# Altium project PCIE to MXM Riser Basic.PrjPcb
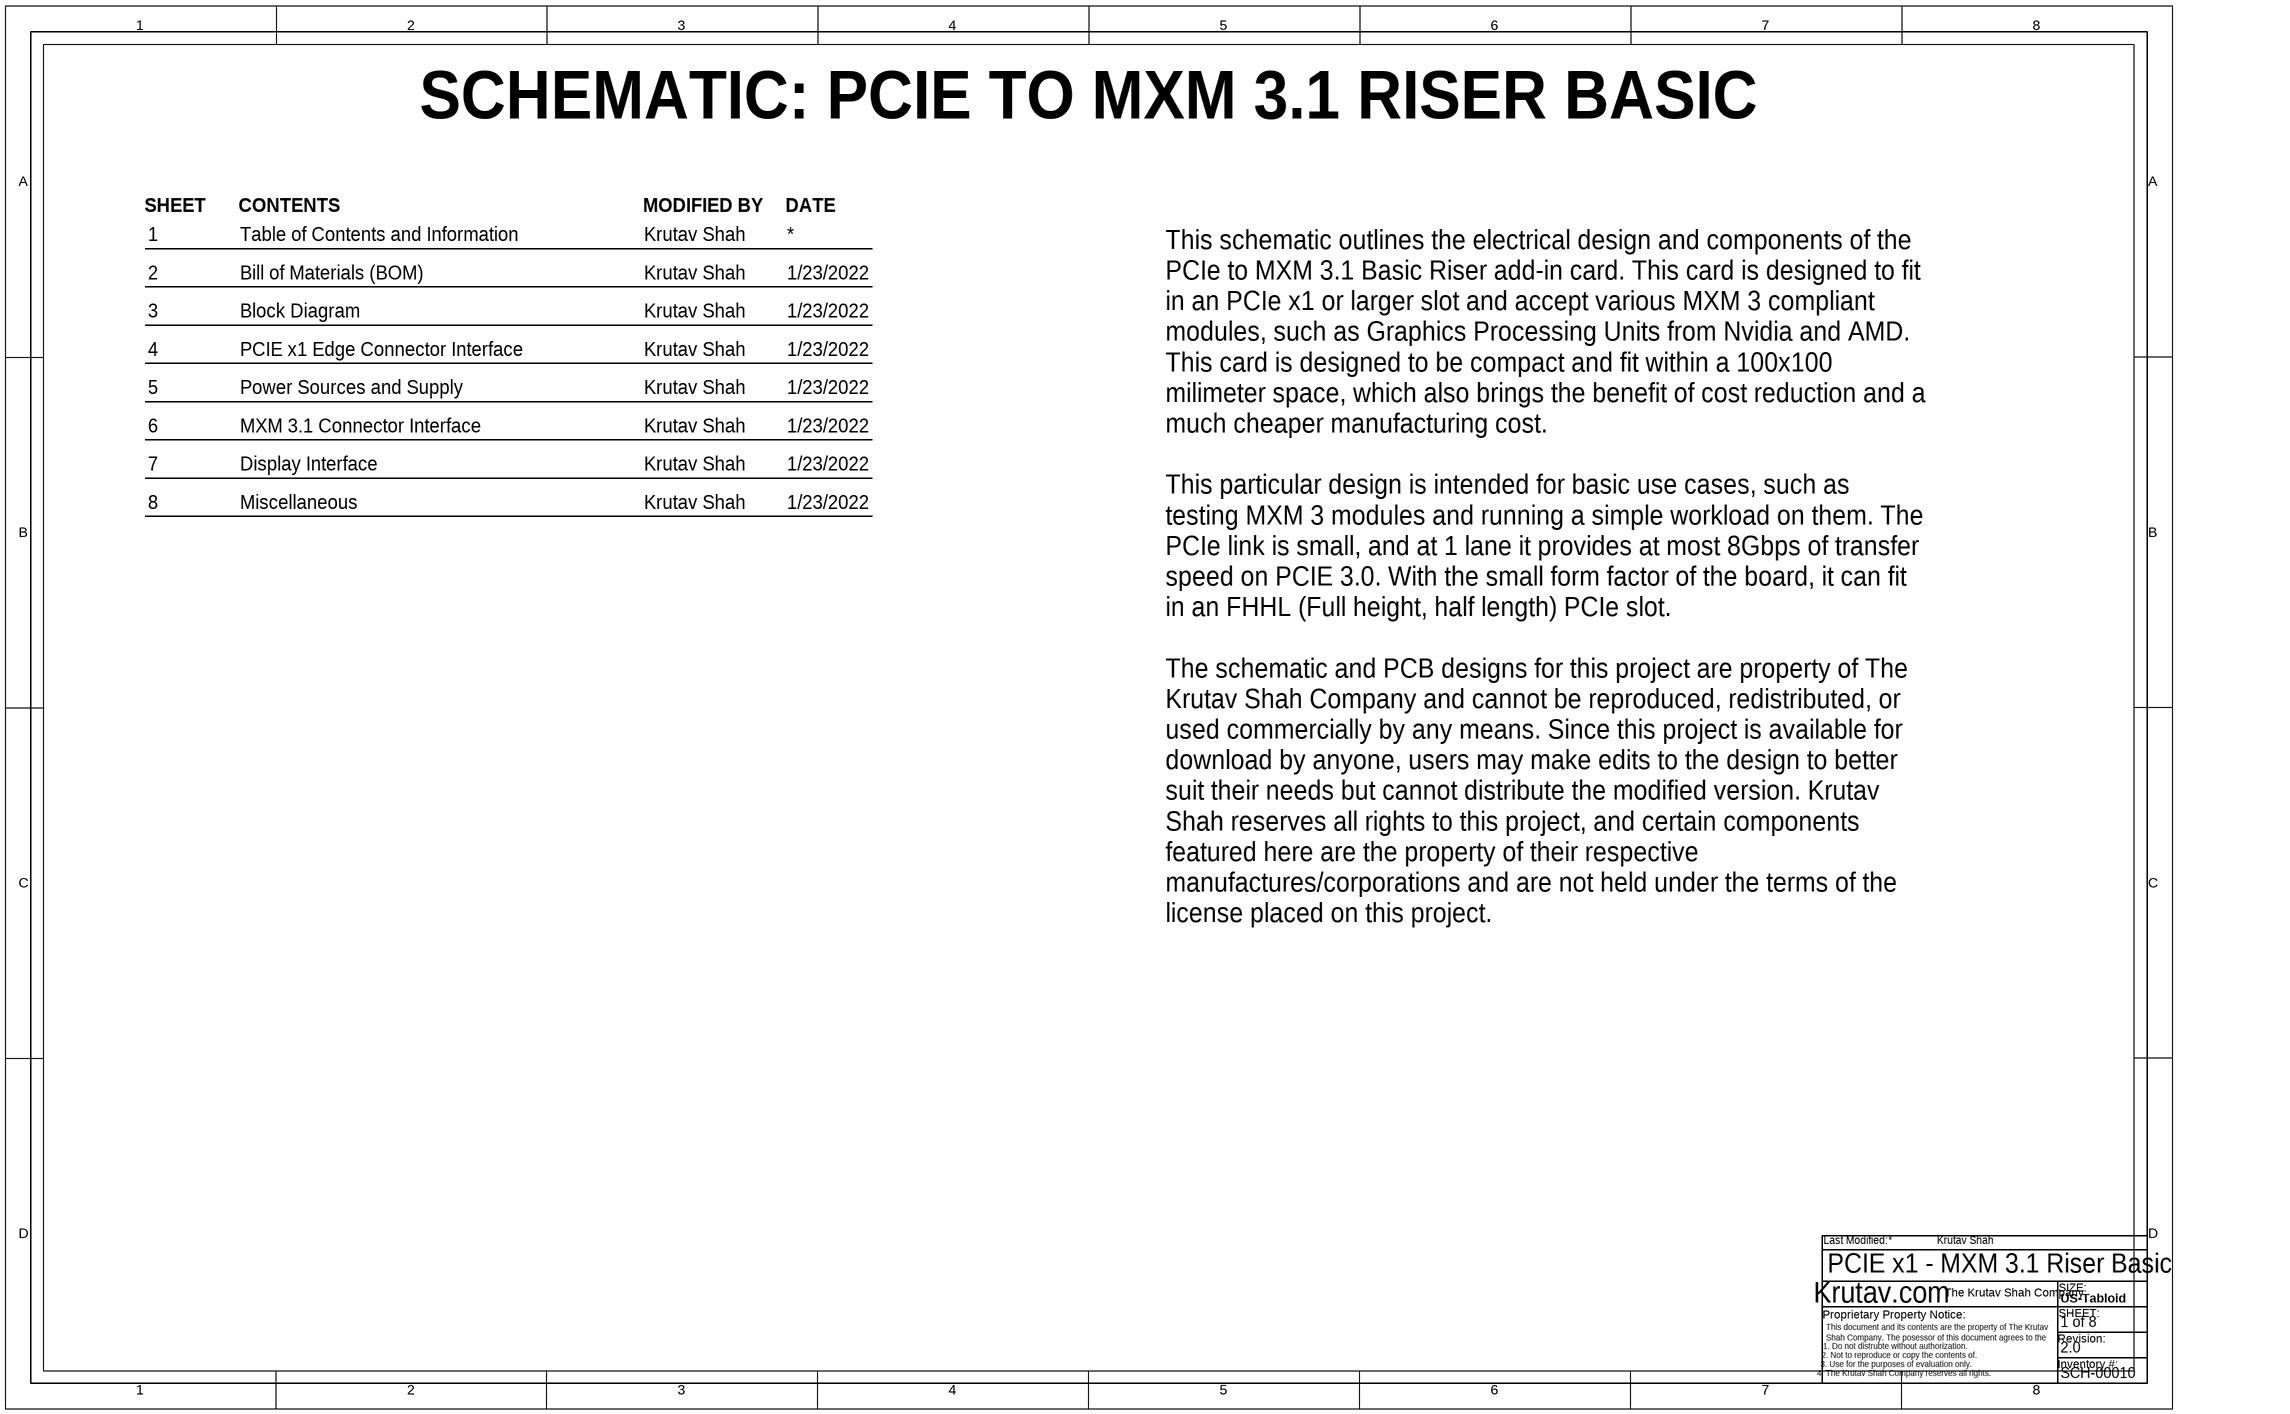
[diagram p0: Table of Contents and Information.SchDoc]
8 sheets, 104 parts. Net scope: flat (ports and power ports of the same name join across sheets).
Board file: PCIE x1 MXM 3.1 Riser Basic.PCBDOC
Sheets:
  Table of Contents and Information.SchDoc
  Bill of Materials.SchDoc
  Block Diagram.SchDoc
  PCIE x1 Edge Connector Interface.SchDoc
  Power Sources and Supply.SchDoc
  MXM 3.1 Connector Interface.SchDoc
  Display Interface.SchDoc
  Miscellaneous.SchDoc

## Sheet Table of Contents and Information.SchDoc: Overview
size Tabloid; Author: Krutav Shah; DrawnBy: Krutav Shah; SheetNumber: 1; SheetTotal: 4; Inventory: SCH-00011

### Notes on the sheet
- SCHEMATIC: PCIE TO MXM 3.1 RISER BASIC
- SHEET
- CONTENTS
- MODIFIED BY
- DATE
- 1
- 2
- Table of Contents and Information
- Bill of Materials (BOM)
- 1/23/2022
- 3
- Block Diagram
- 4
- 5
- PCIE x1 Edge Connector Interface
- Power Sources and Supply
- 6
- 7
- MXM 3.1 Connector Interface
- Display Interface
- 8
- Miscellaneous
- This schematic outlines the electrical design and components of the PCIe to MXM 3.1 Basic Riser add-in card. This card is designed to fit in an PCIe x1 or larger slot and accept various MXM 3 compliant modules, such as Graphics Processing Units from Nvidia and AMD. This card is designed to be compact and fit within a 100x100 milimeter space, which also brings the benefit of cost reduction and a much cheaper manufacturing cost.
  This particular design is intended for basic use cases, such as testing MXM 3 modules and running a simple workload on them. The PCIe link is small, and at 1 lane it provides at most 8Gbps of transfer speed on PCIE 3.0. With the small form factor of the board, it can fit in an FHHL (Full height, half length) PCIe slot.
  The schematic and PCB designs for this project are property of The Krutav Shah Company and cannot be reproduced, redistributed, or used commercially by any means. Since this project is available for download by anyone, users may make edits to the design to better suit their needs but cannot distribute the modified version. Krutav Shah reserves all rights to this project, and certain components featured here are the property of their respective manufactures/corporations and are not held under the terms of the license placed on this project.
- PCIE x1 - MXM 3.1 Riser Basic
- 1 of 8
- 2.0
- SCH-00010
- Last Modified:
- Krutav.com
- The Krutav Shah Company
- US-Tabloid
- SIZE:
- SHEET:
- This document and its contents are the property of The Krutav Shah Company. The posessor of this document agrees to the following:
- Proprietary Property Notice:
- 1. Do not distrubte without authorization.
- 3. Use for the purposes of evaluation only.
- 2. Not to reproduce or copy the contents of.
- 4. The Krutav Shah Company reserves all rights.
- Revision:
- Inventory #:

## Sheet Bill of Materials.SchDoc
size Tabloid; DrawnBy: Krutav Shah; SheetNumber: 2; SheetTotal: 2; Inventory: SCH-00011
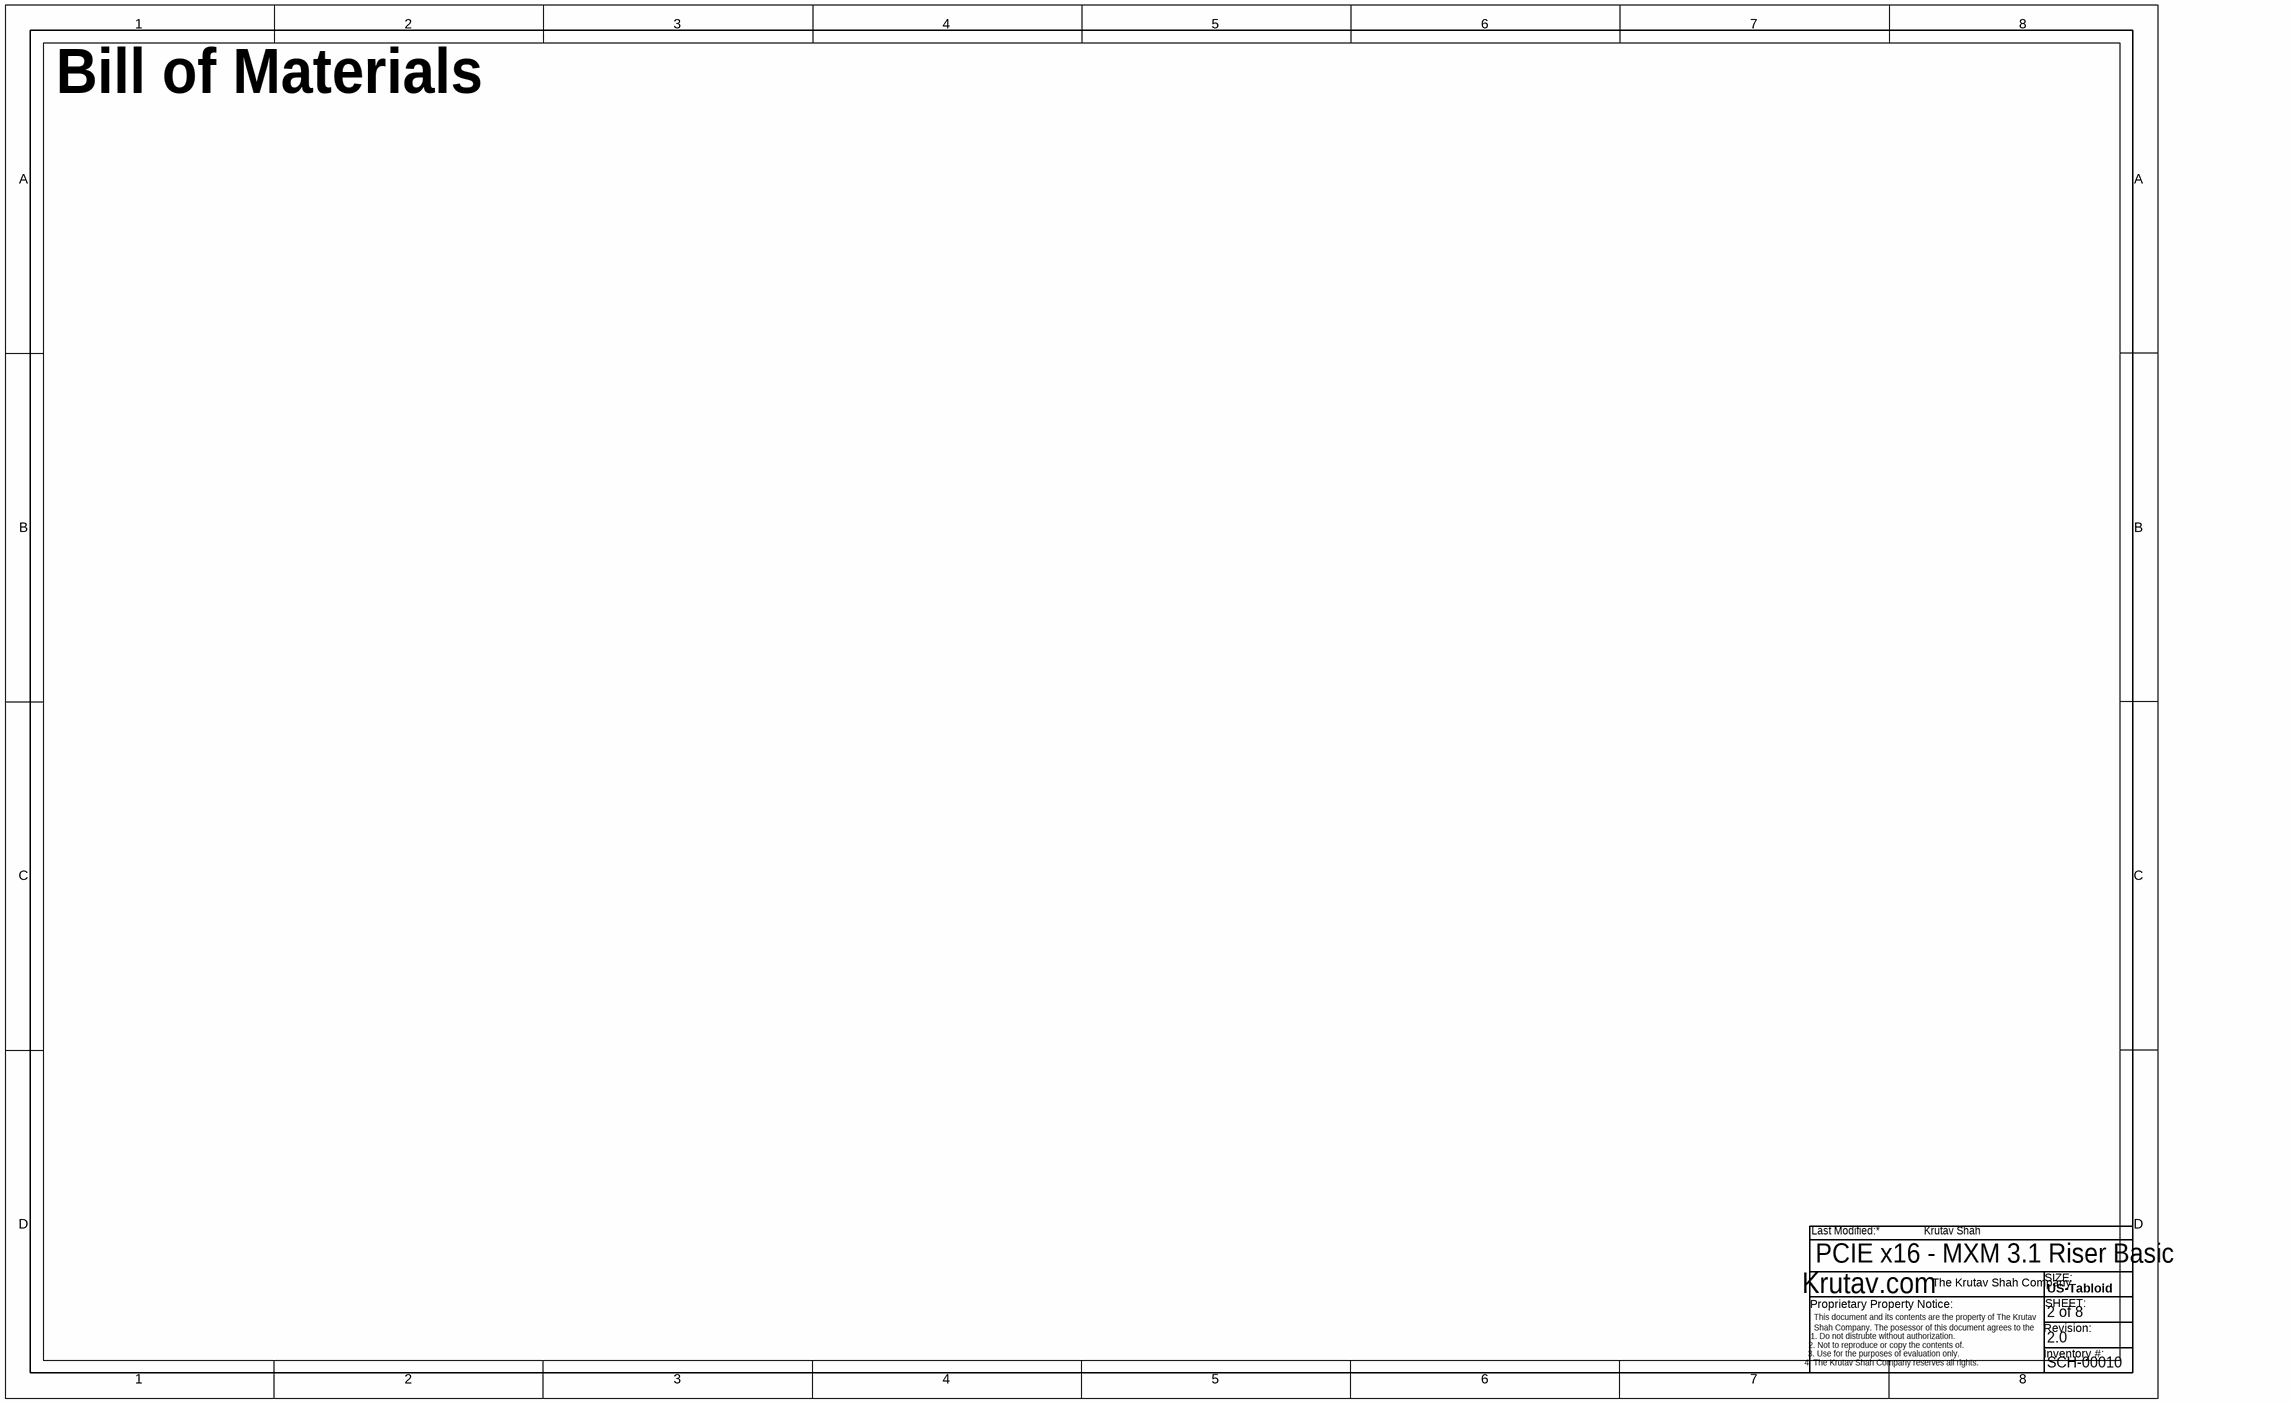
[diagram p1: Bill of Materials.SchDoc]

### Notes on the sheet
- Bill of Materials
- PCIE x16 - MXM 3.1 Riser Basic
- 2 of 8
- 2.0
- SCH-00010
- Last Modified:
- Krutav.com
- The Krutav Shah Company
- US-Tabloid
- SIZE:
- SHEET:
- This document and its contents are the property of The Krutav Shah Company. The posessor of this document agrees to the following:
- Proprietary Property Notice:
- 1. Do not distrubte without authorization.
- 3. Use for the purposes of evaluation only.
- 2. Not to reproduce or copy the contents of.
- 4. The Krutav Shah Company reserves all rights.
- Revision:
- Inventory #:

## Sheet Block Diagram.SchDoc
size Tabloid; DrawnBy: Krutav Shah; SheetNumber: 3; SheetTotal: 3
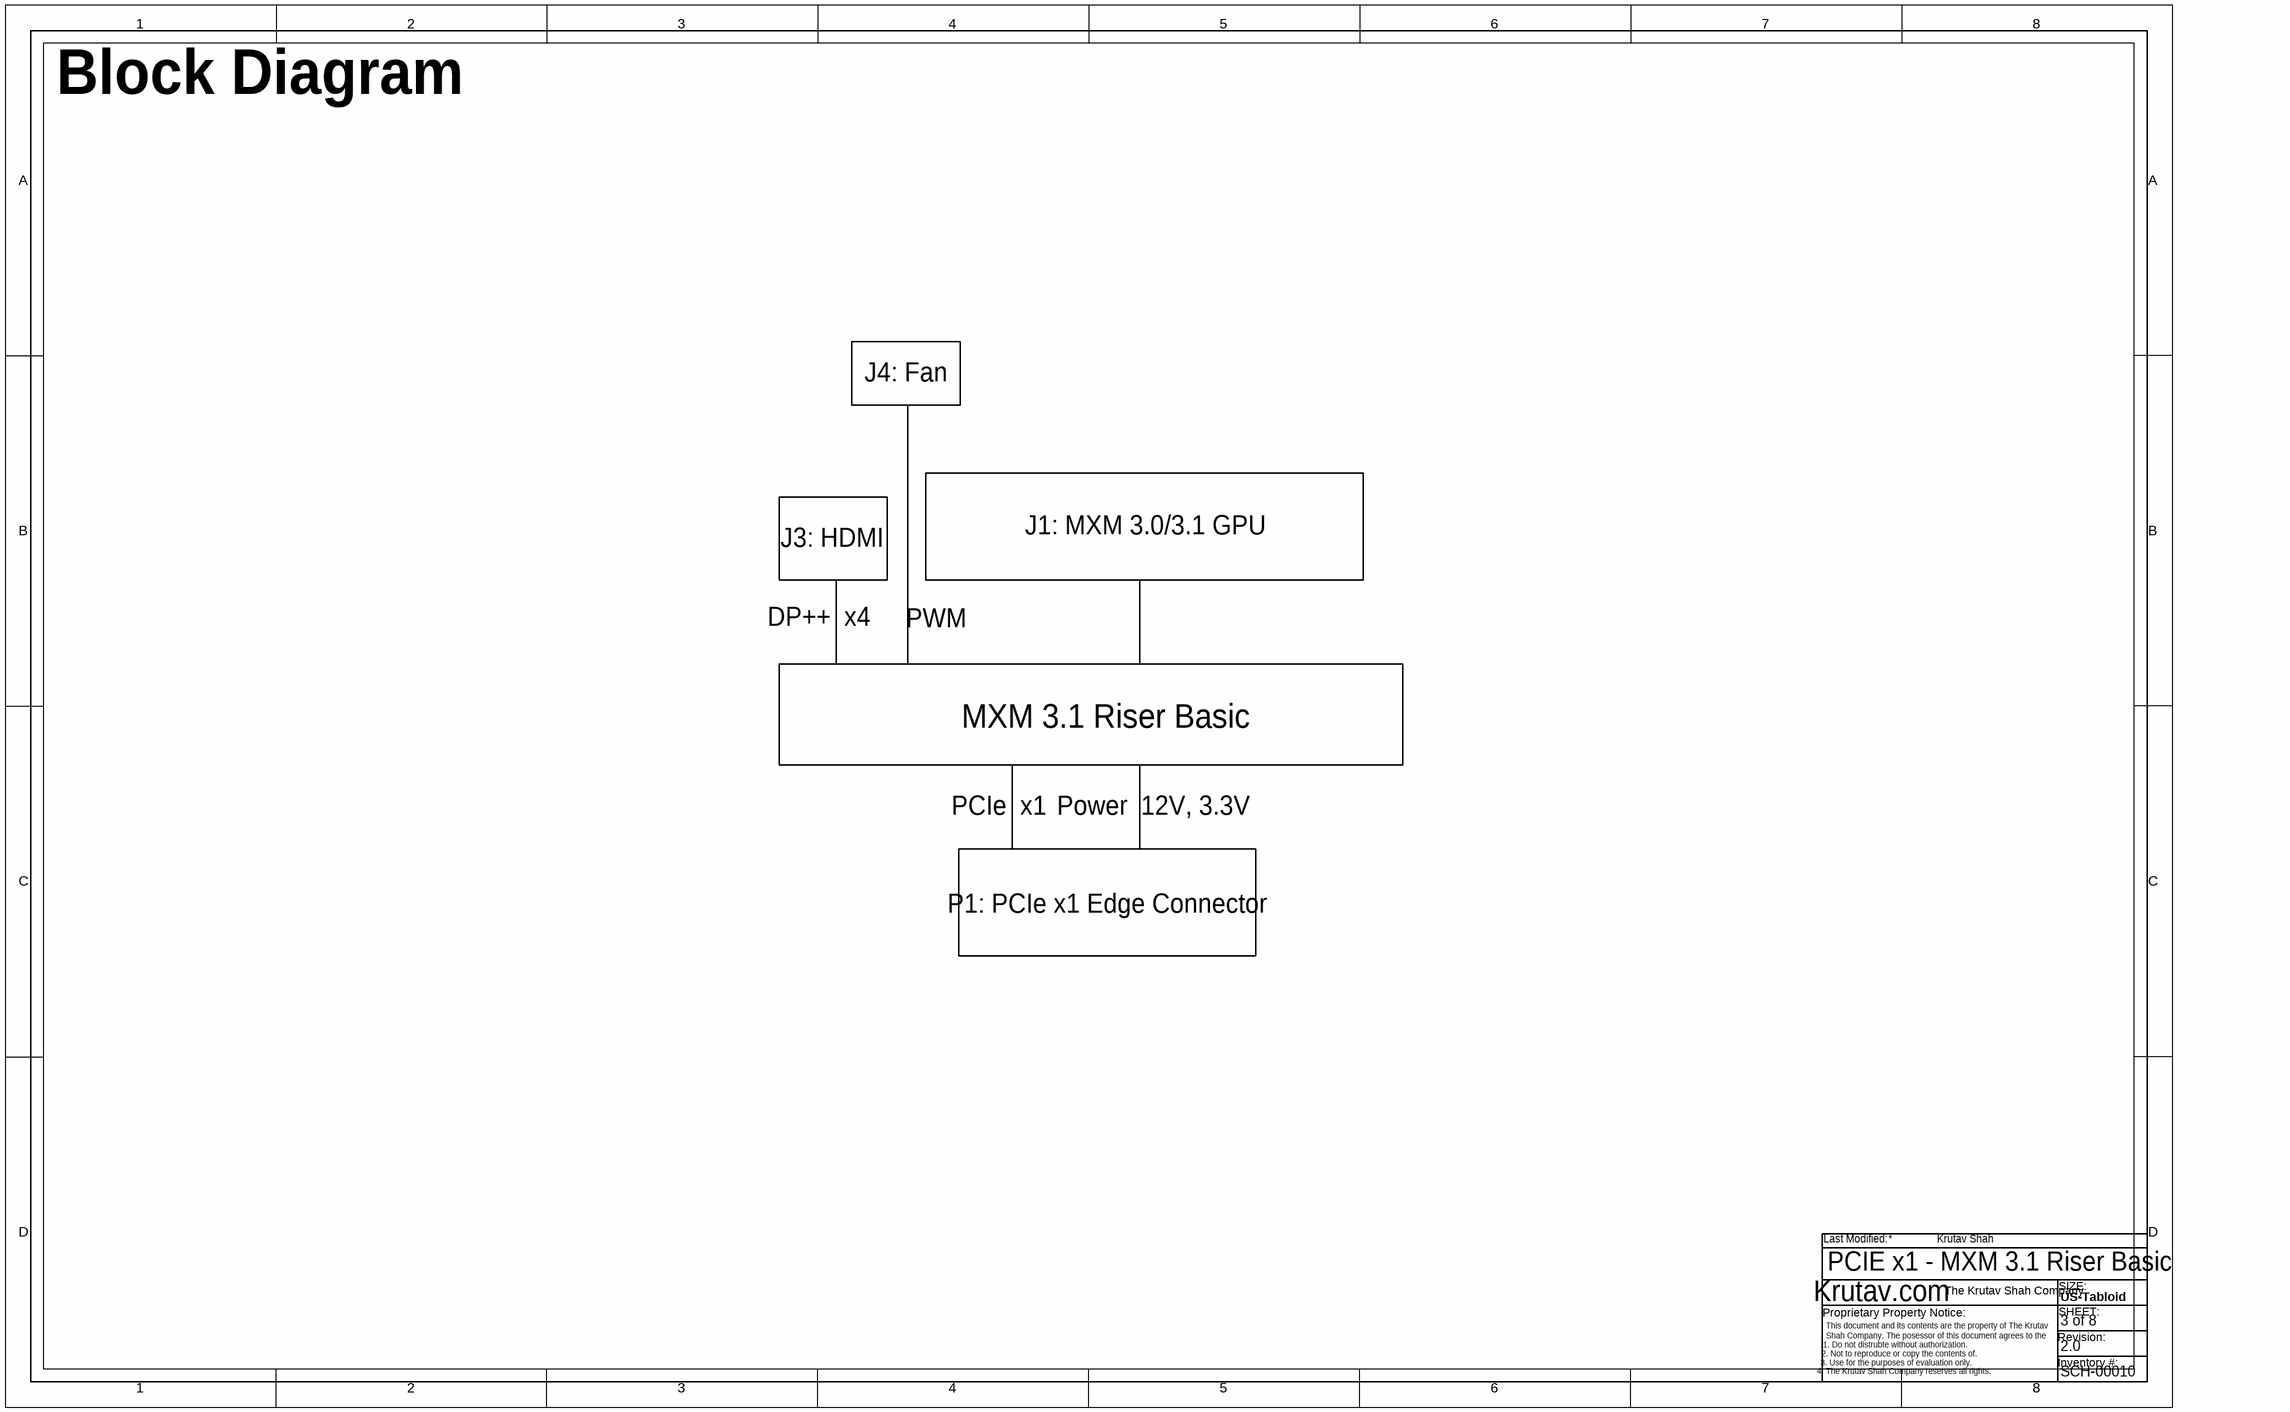
[diagram p2: Block Diagram.SchDoc]

### Notes on the sheet
- Block Diagram
- J4: Fan
- J3: HDMI
- J1: MXM 3.0/3.1 GPU
- DP++  x4
- PWM
- MXM 3.1 Riser Basic
- PCIe  x1
- Power  12V, 3.3V
- P1: PCIe x1 Edge Connector
- PCIE x1 - MXM 3.1 Riser Basic
- 3 of 8
- 2.0
- SCH-00010
- Last Modified:
- Krutav.com
- The Krutav Shah Company
- US-Tabloid
- SIZE:
- SHEET:
- This document and its contents are the property of The Krutav Shah Company. The posessor of this document agrees to the following:
- Proprietary Property Notice:
- 1. Do not distrubte without authorization.
- 3. Use for the purposes of evaluation only.
- 2. Not to reproduce or copy the contents of.
- 4. The Krutav Shah Company reserves all rights.
- Revision:
- Inventory #:

## Sheet PCIE x1 Edge Connector Interface.SchDoc
size Tabloid; DrawnBy: Krutav Shah; SheetNumber: 4; SheetTotal: 6
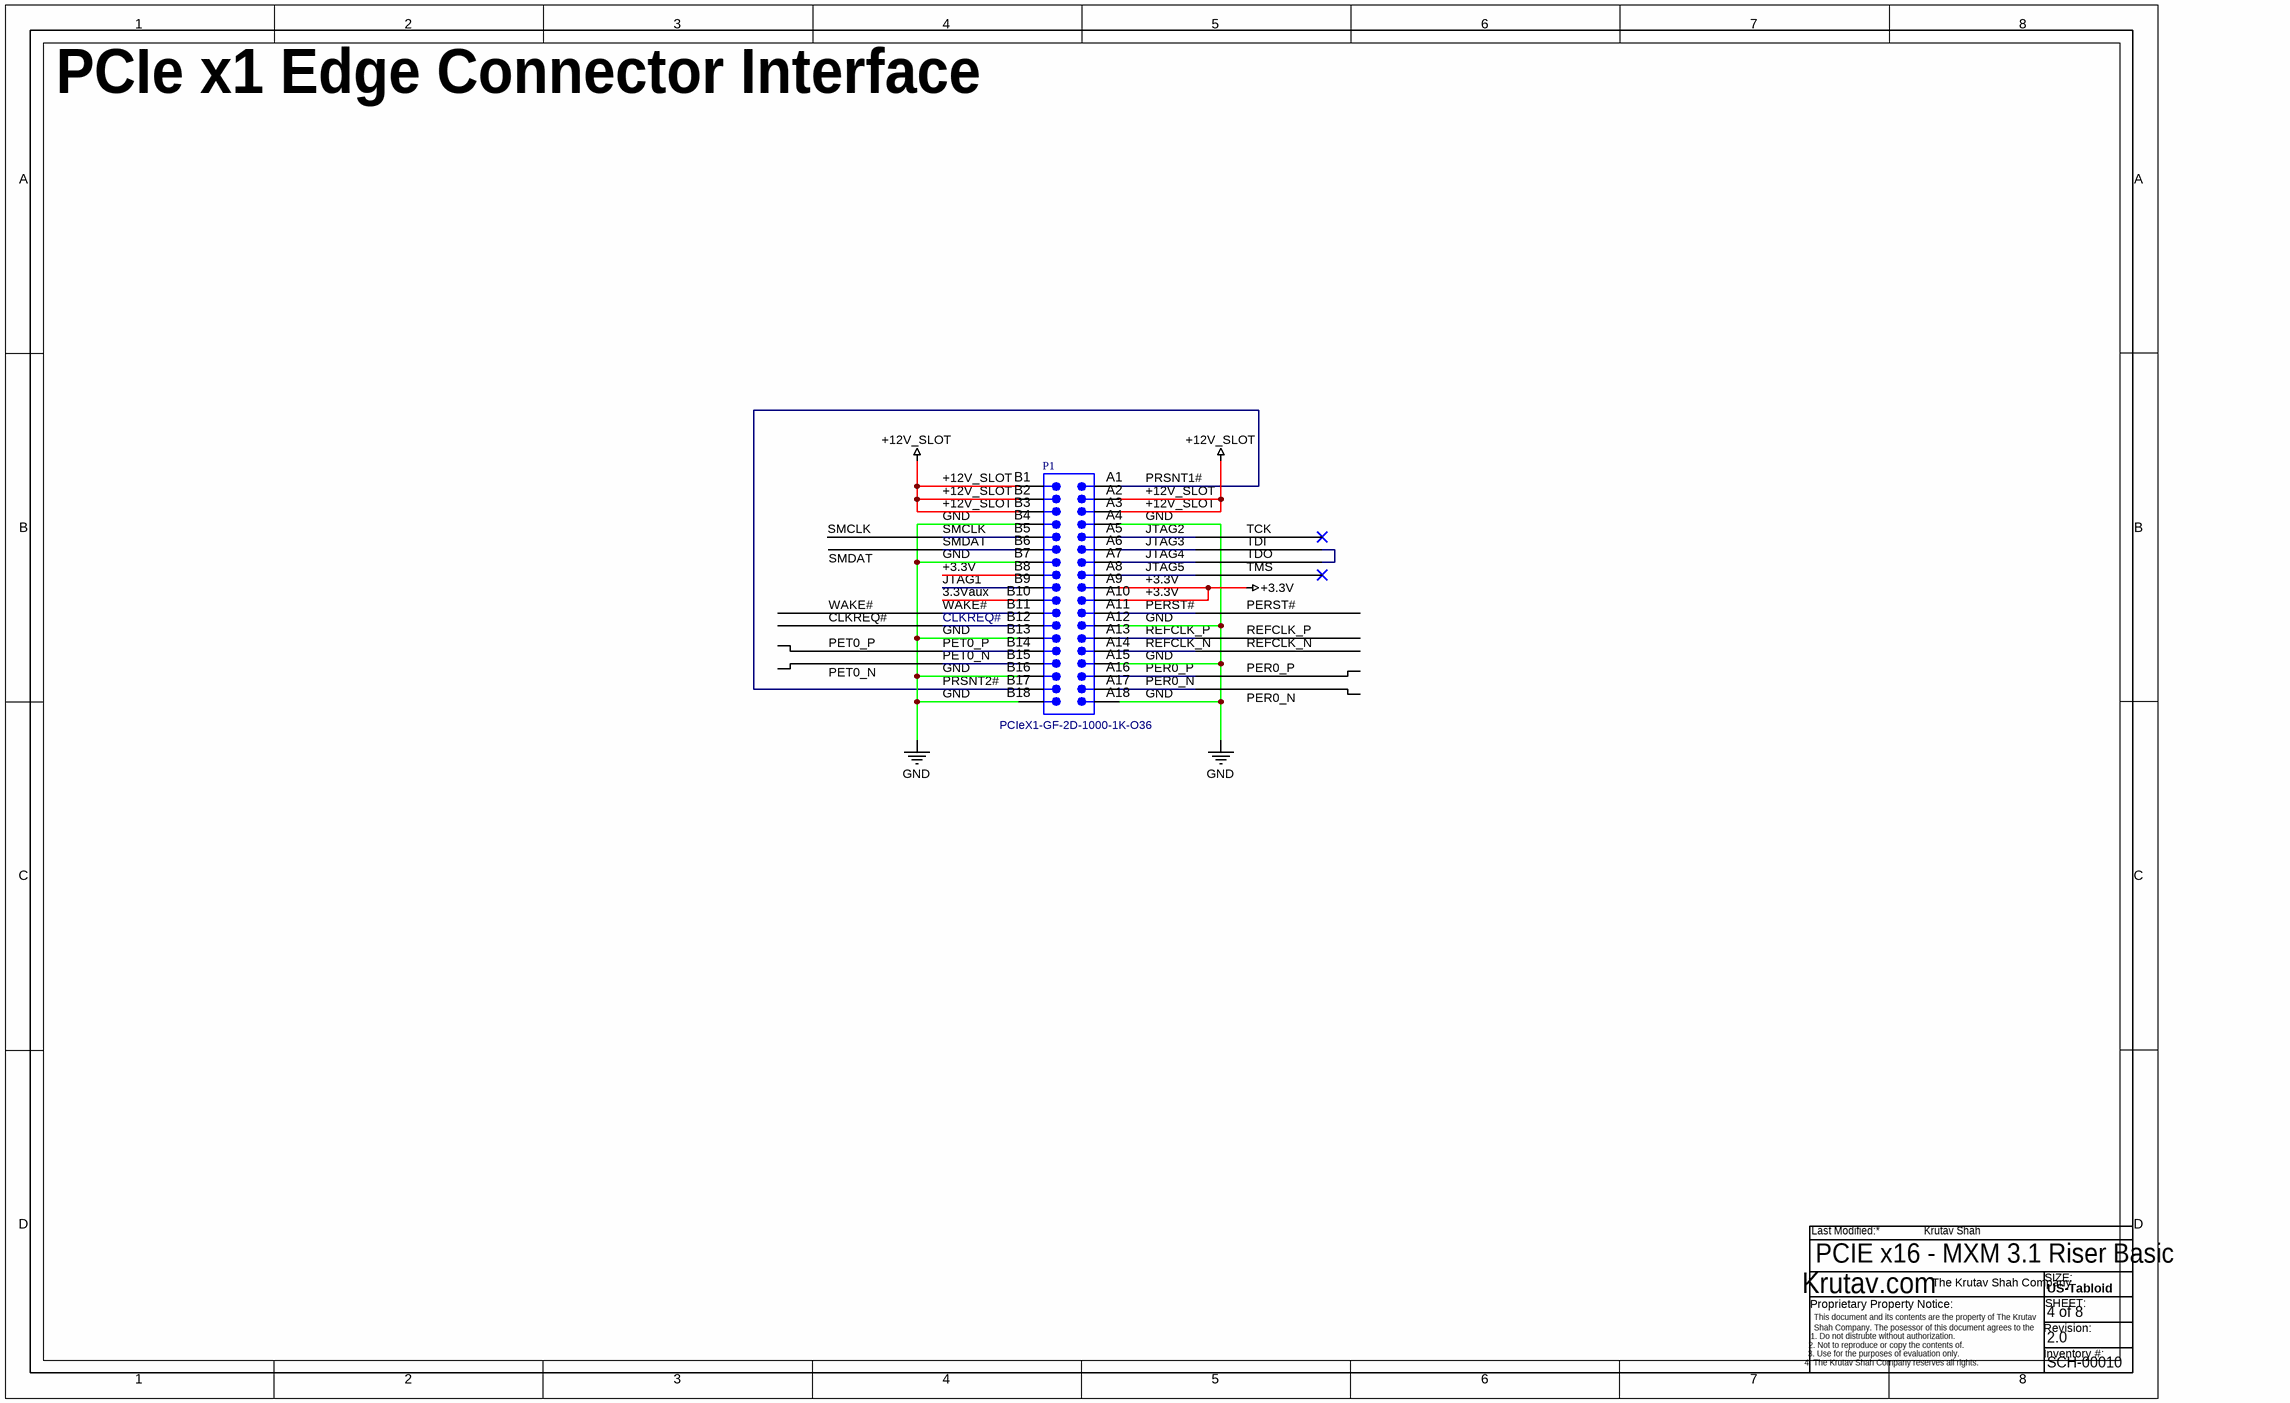
[diagram p3: PCIE x1 Edge Connector Interface.SchDoc]

### Parts
P1  PCIeX1-GF-2D-1000-1K-O36  [PCIeX1-GF-2D-1000-1K-O36]  (no BOM)

### Nets
+3.3V: P1.A9 P1.A10 P1.B8
+12V_SLOT: P1.A2 P1.A3 P1.B1 P1.B2 P1.B3
GND: P1.A4 P1.A12 P1.A15 P1.A18 P1.B4 P1.B7 P1.B13 P1.B16 P1.B18
3.3Vaux: P1.B10
CLKREQ#: P1.B12
JTAG1: P1.B9
JTAG2: P1.A5  [also labelled TCK]
JTAG3: P1.A6 P1.A7  [also labelled JTAG4, TDI, TDO]
JTAG5: P1.A8  [also labelled TMS]
PER0_N: P1.A17
PER0_P: P1.A16
PERST#: P1.A11
PET0_N: P1.B15
PET0_P: P1.B14
PRSNT1#: P1.A1 P1.B17  [also labelled PRSNT2#]
REFCLK_N: P1.A14
REFCLK_P: P1.A13
SMCLK: P1.B5
SMDAT: P1.B6
WAKE#: P1.B11

### Layout directives
differential pair: PER0_N, PER0_P, PET0_N, PET0_P, REFCLK_N, REFCLK_P

### Notes on the sheet
- PCIe x1 Edge Connector Interface
- CLKREQ#
- PCIE x16 - MXM 3.1 Riser Basic
- 4 of 8
- 2.0
- SCH-00010
- Last Modified:
- Krutav.com
- The Krutav Shah Company
- US-Tabloid
- SIZE:
- SHEET:
- This document and its contents are the property of The Krutav Shah Company. The posessor of this document agrees to the following:
- Proprietary Property Notice:
- 1. Do not distrubte without authorization.
- 3. Use for the purposes of evaluation only.
- 2. Not to reproduce or copy the contents of.
- 4. The Krutav Shah Company reserves all rights.
- Revision:
- Inventory #:

### Library data of the parts
P1 = CMP-0001-00030-2: Golden finger, PCIeX1, Dual, Opposite, Pitch 1mm, 36-Position; Mating Connector: Molex-87715-9006; Package Reference: PCIeX1-GF-2D-1000-1K-O36; ClassName: Edge Connector; Publisher: Altium; Datasheet Version: rev2.0, Apr-2007

## Sheet Power Sources and Supply.SchDoc
size Tabloid; DrawnBy: Krutav Shah; SheetNumber: 4; SheetTotal: 6
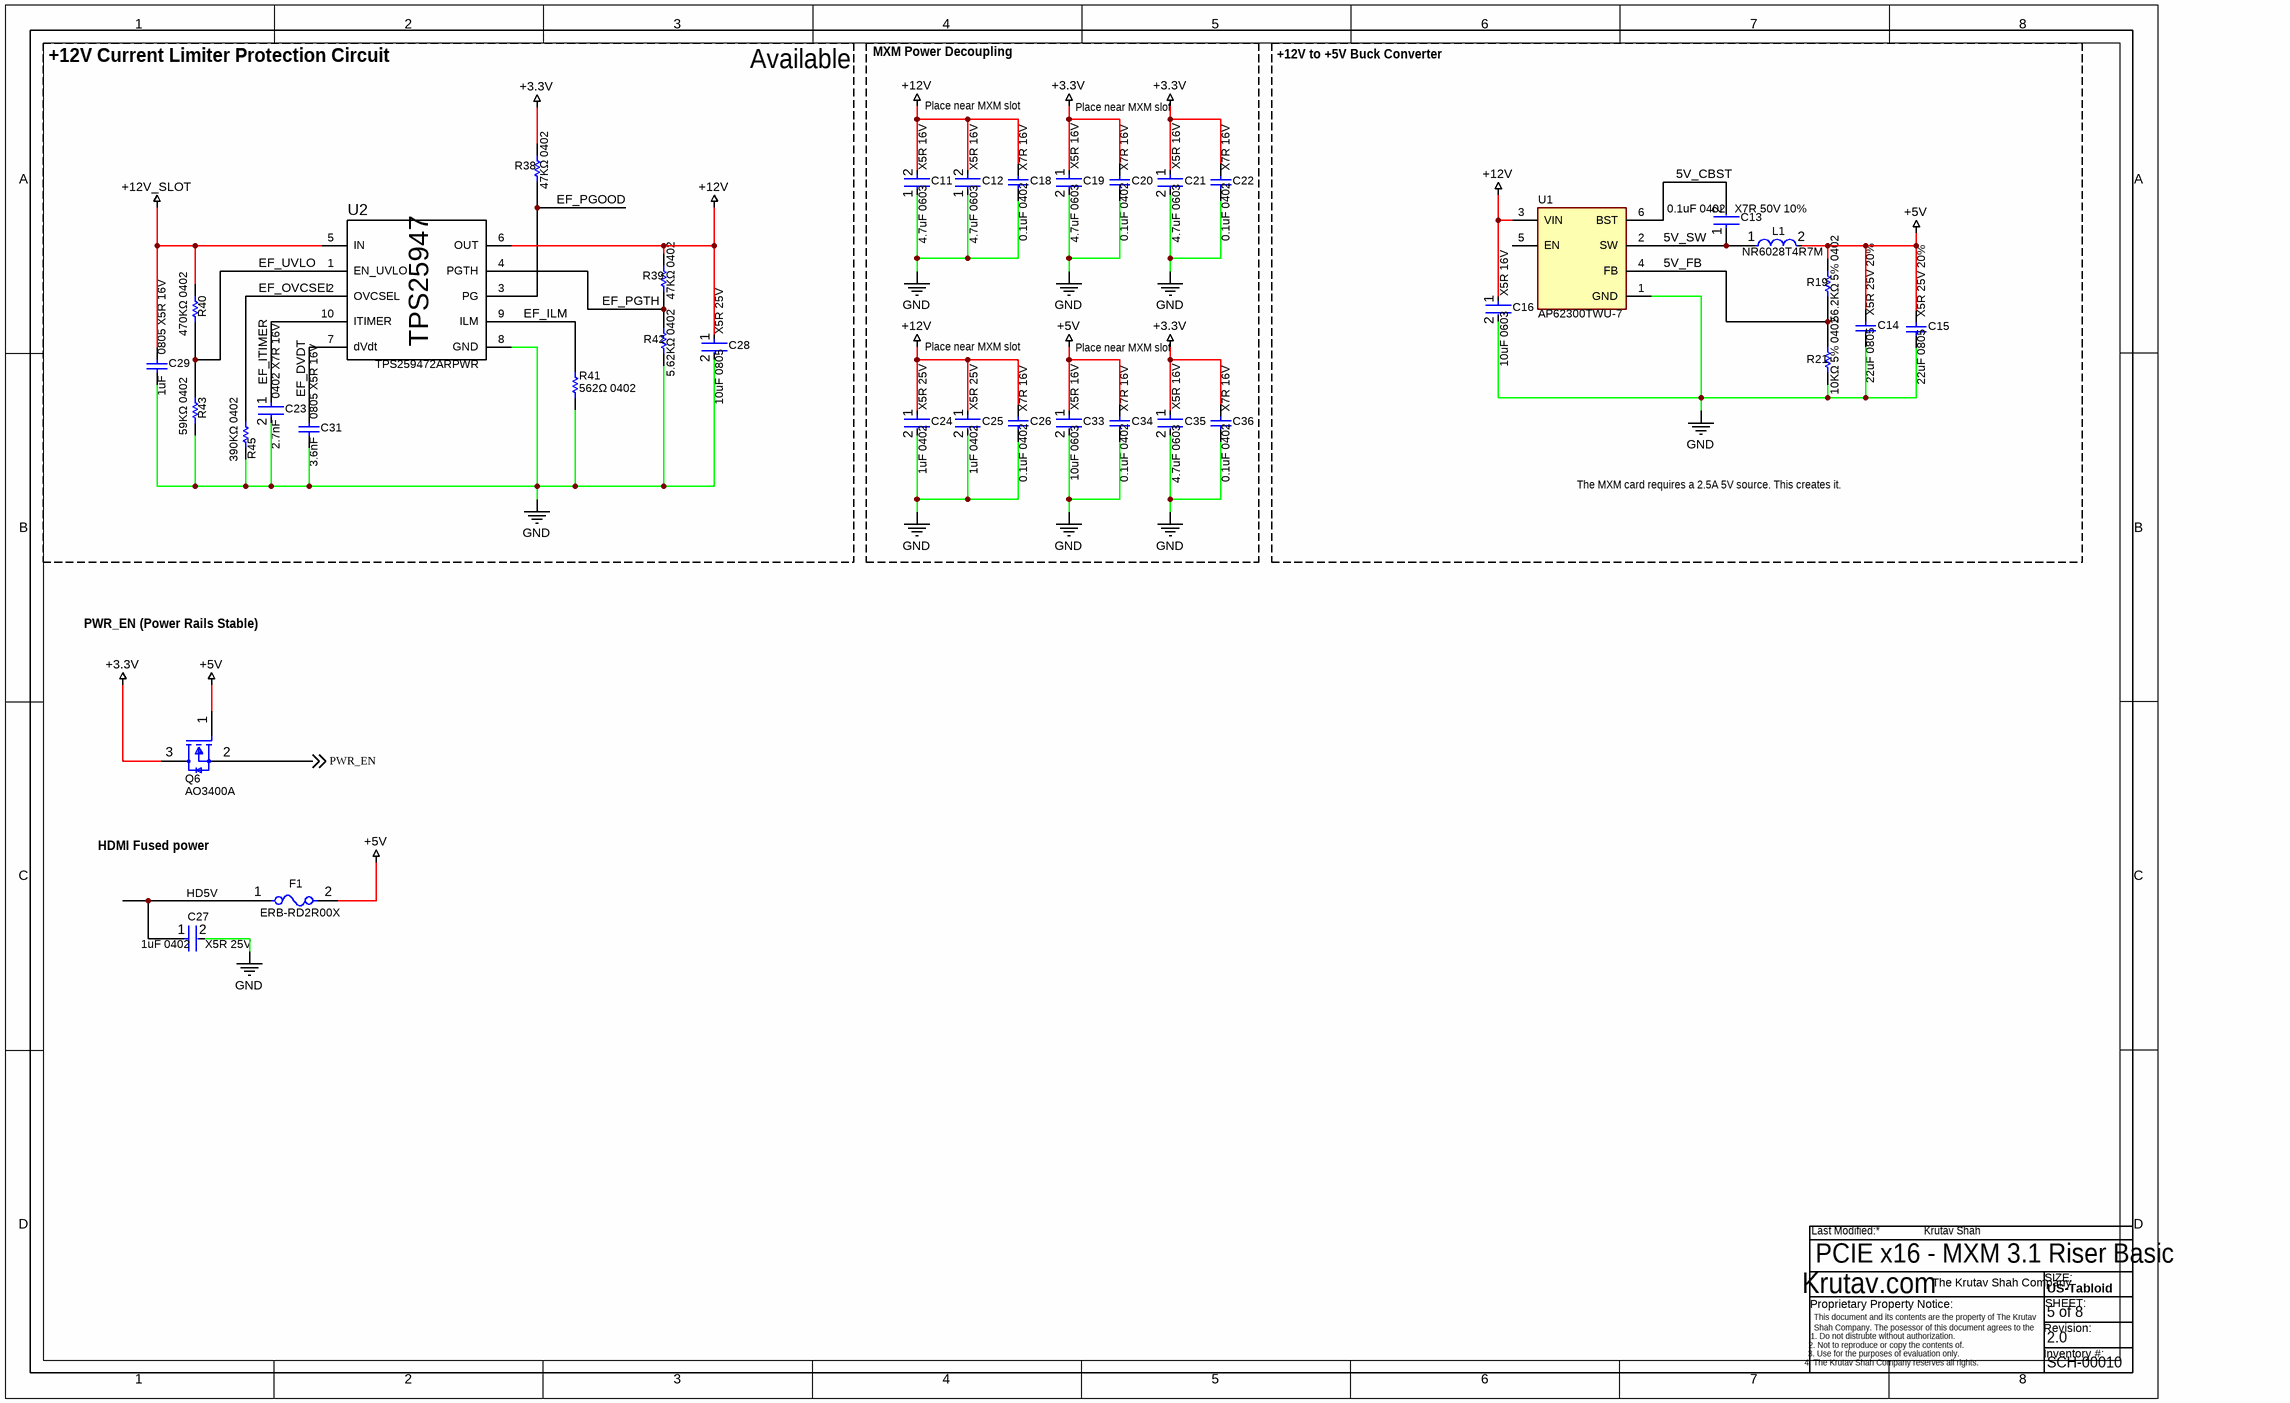
[diagram p4: Power Sources and Supply.SchDoc]

### Parts
C11  4.7uF 0603     X5R 16V  [FP-C1608-080-0_1-IPC_C]
C12  4.7uF 0603     X5R 16V  [FP-C1608-080-0_1-IPC_C]
C13  0.1uF 0402   X7R 50V 10%  [FP-CL779-IPC_C]
C14  22uF 0805    X5R 25V 20%  [CAPC2013X140X45LL15T25]
C15  22uF 0805    X5R 25V 20%  [CAPC2013X140X45LL15T25]
C16  10uF 0603     X5R 16V  [FP-CL21-IPC_A]
C18  0.1uF 0402    X7R 16V  [CAPC1050X55X23ML05T13]
C19  4.7uF 0603     X5R 16V  [FP-CL21-IPC_A]
C20  0.1uF 0402    X7R 16V  [CAPC1050X55X23ML05T13]
C21  4.7uF 0603     X5R 16V  [FP-CL21-IPC_A]
C22  0.1uF 0402    X7R 16V  [CAPC1050X55X23ML05T13]
C23  2.7nF       0402 X7R 16V  [FP-C0402-BB-MFG]
C24  1uF 0402     X5R 25V  [FP-CL542-IPC_C]
C25  1uF 0402     X5R 25V  [FP-CL542-IPC_C]
C26  0.1uF 0402    X7R 16V  [CAPC1050X55X23ML05T13]
C27  1uF 0402     X5R 25V  [FP-CL542-IPC_C]
C28  10uF 0805     X5R 25V  [FP-CL21-IPC_A]
C29  1uF       0805 X5R 16V  [CAPC0603X33X15NL03T05]
C31  3.6nF      0805 X5R 16V  [CAPC0603X33X15NL03T05]
C33  10uF 0603     X5R 16V  [FP-CL21-IPC_A]
C34  0.1uF 0402    X7R 16V  [CAPC1050X55X23ML05T13]
C35  4.7uF 0603     X5R 16V  [FP-CL21-IPC_A]
C36  0.1uF 0402    X7R 16V  [CAPC1050X55X23ML05T13]
F1  ERB-RD2R00X  [FP-ERBRD-MFG]
L1  NR6028T4R7M  [FP-NR6028-MFG]
Q6  AO3400A  [FP-SOT23-MFG]
R19  56.2KΩ 5% 0402  [RESC0201(0603)_L]
R21  10KΩ 5% 0402  [RESC0201(0603)_L]
R38  47KΩ 0402  [RESC0201(0603)_L]
R39  47KΩ 0402  [RESC0201(0603)_L]
R40  470KΩ 0402  [RESC0201(0603)_L]
R41  562Ω 0402  [RESC0201(0603)_L]
R42  5.62KΩ 0402  [RESC0201(0603)_L]
R43  59KΩ 0402  [RESC0201(0603)_L]
R45  390KΩ 0402  [RESC0201(0603)_L]
U1  AP62300TWU-7  [FP-TSOT26-MFG]
U2  TPS259472ARPWR  [RPW0010A-MFG]

### Blocks framed on the sheet
Available: C23 C28 C29 C31 R38-R43 R45 U2
MXM Power Decoupling: C11 C12 C18-C22 C24-C26 C33-C36
+12V to +5V Buck Converter: C13-C16 L1 R19 R21 U1

### Nets
+3.3V: C19.1 C20.2 C21.1 C22.2 C35.1 C36.2 Q6.3(D) R38.1
+5V: C14.2 C15.2 C33.1 C34.2 F1.2 L1.2 Q6.1(G) R19.1
+12V: C11.2 C12.2 C16.1 C18.2 C24.1 C25.1 C26.2 C28.1 R39.1 U1.3(VIN) U2.6(OUT)
+12V_SLOT: C29.1 R40.1 U2.5(IN)
GND: C11.1 C12.1 C14.1 C15.1 C16.2 C18.1 C19.2 C20.1 C21.2 C22.1 C23.2 C24.2 C25.2 C26.1 C27.2 C28.2 C29.2 C31.2 C33.2 C34.1 C35.2 C36.1 R21.1 R41.2 R42.1 R43.1 R45.2 U1.1(GND) U2.8(GND)
5V_CBST: C13.2 U1.6(BST)
5V_FB: R19.2 R21.2 U1.4(FB)
5V_SW: C13.1 L1.1 U1.2(SW)
EF_DVDT: C31.1 U2.7(dVdt)
EF_ILM: R41.1 U2.9(ILM)
EF_ITIMER: C23.1 U2.10(ITIMER)
EF_OVCSEL: R45.1 U2.2(OVCSEL)
EF_PGOOD: R38.2 U2.3(PG)
EF_PGTH: R39.2 R42.2 U2.4(PGTH)
EF_UVLO: R40.2 R43.2 U2.1(EN_UVLO)
PWR_EN: Q6.2(S) ; off-sheet PWR_EN
NetC27_1: C27.1 F1.1

Not connected (* = marked no-connect by the designer): U1 5(EN)

### Notes on the sheet
- +12V Current Limiter Protection Circuit
- Place near MXM slot
- The MXM card requires a 2.5A 5V source. This creates it.
- PWR_EN (Power Rails Stable)
- HDMI Fused power
- (near C27) HD5V
- PCIE x16 - MXM 3.1 Riser Basic
- 5 of 8
- 2.0
- SCH-00010
- Last Modified:
- Krutav.com
- The Krutav Shah Company
- US-Tabloid
- SIZE:
- SHEET:
- This document and its contents are the property of The Krutav Shah Company. The posessor of this document agrees to the following:
- Proprietary Property Notice:
- 1. Do not distrubte without authorization.
- 3. Use for the purposes of evaluation only.
- 2. Not to reproduce or copy the contents of.
- 4. The Krutav Shah Company reserves all rights.
- Revision:
- Inventory #:
- (in symbol TPS259474ARPWR) TPS25947

### Library data of the parts
C11 C12 = CMP-2000-04981-2: Multilayer Ceramic Capacitors 4.7μF ±10% 16V X5R SMD 0603; Tolerance: 10%; Thickness: 0.035inch; Length: 1.6mm; Width: 0.031inch; Height: 0.8mm; Package Quantity: 1; Voltage: 16V; Construction: Flat; Weight: 7.1E-05oz; Depth: 0.8mm; Case Code (Metric): 1608; Series: C; Lead Free: Lead Free; Voltage Rating: 16V; Voltage Rating (DC): 16V; Capacitance: 4.7uF; Termination: SMD/SMT; Dielectric: X5R; REACH SVHC: No SVHC; RoHS Compliant: Yes; Case Code (Imperial): 0603; Case/Package: 0603; Mount: Surface Mount; Dielectric Material: Ceramic; Packaging: Tape and Reel; Min Operating Temperature: -55°C; Max Operating Temperature: 85°C
C13 = CMP-13271-002336-1: Cap Ceramic 100nF 50V X7R ±10% SMD 0402 +125°C Paper T/R
C14 C15 = CMP-2000-06104-1: Multi-layer Ceramic Capacitor, 22 uF, -55 to 85 degC, 2-Pin SMD (0805), RoHS, Tape and Reel; Manufacturer: Samsung Electro-Mechanics; Other Names: 1276-2908-2; Capacitance: 22µF; Featured Product: Multi-LayerCeramicCapacitors; Product Training Modules: HighCapMLCCFamily; Online Catalog: CLSeries,HighCapacitance; Applications: GeneralPurpose; RoHS Information: MLCCRoHS2Compliance; Height - Seated (Max): -; Voltage - Rated: 25V; Lead Style: -; Lead Spacing: -; Datasheet URL: http://datasheet.octopart.com/CL21A226MAQNNNE-Samsung-datasheet-48647558.pdf; Size / Dimension: 0.079"Lx0.049"W(2.00mmx1.25mm); Temperature Coefficient: X5R; Thickness (Max): 0.055"(1.40mm); Family: CeramicCapacitors; Package Description: 2-Pin Surface Mount Device, Body 2.0 x 1.25 mm; Datasheet Version: 07/2015; Packaging: Tape&Reel(TR); Manufacturer URL: http://www.samsungsem.com/global/index.jsp; Ratings: -; Package / Case: 0805(2012Metric); Tolerance: ±20%; Standard Package: 2,000; Mounting Type: SurfaceMount,MLCC; Mounting Technology: SurfaceMount; Category: Capacitors; Package Reference: 0805; Series: CL; Features: -; Operating Temperature: -55°C~85°C
C16 C33 = CMP-13271-002624-1: CL10A106KP8NNNC Series 0603 10uF 10V ±10% Tolerance X5R Multilayer Ceramic Chip Capacitor; Capacitance: 4.7uF; Voltage Rating: 25V; Case Code (Imperial): 0805; Thickness: 0.055inch; Mount: Surface Mount; Case Code (Metric): 2012; Depth: 1.25mm; Lead Free: Lead Free; Case/Package: 0805; Package Quantity: 1; Width: 0.049inch; Radiation Hardening: No; Voltage Rating (DC): 25V; Length: 2mm; Dielectric: X5R; Height: 1.25mm; Packaging: Tape and Reel; Tolerance: 10%; Min Operating Temperature: -55°C; Max Operating Temperature: 85°C
C18 C20 C22 C26 C34 C36 = CMP-2000-05439-1: Chip Capacitor, 100 nF, +/- 10%, 16 V, -55 to 125 degC, 0402 (1005 Metric), RoHS, Tape and Reel; Manufacturer: Samsung Electro-Mechanics; Capacitance: 100000pF; Case Size/Dimension: 0402; Tolerance (%): ±10%; Manufacturer URL: http://www.samsungsem.com/global/index.jsp; Dielectric: X7R; Datasheet URL: https://datasheet.ciiva.com/29198/458718-da-01-en-vs-kondensator-0402-29198423.pdf; Rated Voltage: 16V; Datasheet Version: Nov-10
C19 C21 C35 = CMP-13271-002624-1: CL21 Series 0805 4.7uF 25V ±10% Tolerance X5R Multilayer Ceramic Chip Capacitor; Case Code (Imperial): 0805; Thickness: 0.055inch; Mount: Surface Mount; Case Code (Metric): 2012; Capacitance: 4.7uF; Depth: 1.25mm; Lead Free: Lead Free; Case/Package: 0805; Voltage Rating: 25V; Package Quantity: 1; Width: 0.049inch; Radiation Hardening: No; Voltage Rating (DC): 25V; Length: 2mm; Dielectric: X5R; Height: 1.25mm; Packaging: Tape and Reel; Tolerance: 10%; Min Operating Temperature: -55°C; Max Operating Temperature: 85°C
C23 = CMP-2008-02106-2: CAP CER 2700PF 16V X7R 0402; Manufacturer Part Number: C0402C272K4RACTU; Manufacturer: Kemet; Value: 2,700 pF; Temperature Coefficient: 15%; Material: Ceramic; Tolerance: 0.1; Temperature Characteristic: X7R; ComponentLink2Description: Datasheet; Automotive: No; Temperature Range High: +125°C; Octopart: https://octopart.com/c0402c272k4ractu-kemet-12595530; Device Class L2: Capacitors; Category: Cap; Device Class L1: Passive Components; Temperature Range Low: -55°C; Height: 0.55mm; ComponentLink2URL: https://content.kemet.com/datasheets/KEM_C1002_X7R_SMD.pdf; Temperature: -55°C to +125°C; Package: C0402-BB; Device Class L3: Ceramic Capacitors; Ipc Land Pattern Name: CAPC10050X50; Digikey Description: CAP CER 2700PF 16V X7R 0402; Lead Free: Yes; Voltage Rating: 16 V; RoHS: TRUE; Capacitance: 2,700 pF; Mouser Description: Cap Ceramic 0.0027uF 16V X7R 10% SMD 0402 125°C Paper T/R
C24 C25 C27 = CMP-13271-001051-1: Cap Ceramic 1uF 25V X5R ±10% SMD 0402 +85°C Paper T/R; Radiation Hardening: No; Lead Free: Lead Free; Capacitance: 1uF; Package Quantity: 10000; Max Operating Temperature: 85°C; Voltage Rating: 25V; Case/Package: 0402; Min Operating Temperature: -55°C; Packaging: Tape and Reel; Tolerance: 10%; Height: 0.5mm; Thickness: 0.022inch; Case Code (Metric): 1005; Width: 0.02inch; Case Code (Imperial): 0402; Dielectric: X5R; Length: 1mm; Mount: Surface Mount; Material: Ceramic; Depth: 0.5mm
C28 = CMP-13271-002975-1: CL21 Series 0805 10uF 25V ±10% Tolerance X5R Multilayer Ceramic Chip Capacitor; Case Code (Imperial): 0805; Length: 2mm; Case/Package: 0805; Packaging: Tape and Reel; Width: 0.049inch; Tolerance: 10%; Mount: Surface Mount; Min Operating Temperature: -55°C; Thickness: 0.057inch; Height: 1.25mm; Dielectric: X5R; Package Quantity: 1; Depth: 1.25mm; Capacitance: 10uF; Voltage Rating: 25V; Case Code (Metric): 2012; Max Operating Temperature: 85°C; Radiation Hardening: No
C29 C31 = CMP-2010-00679-1: Manufacturer: Samsung; Part Number: CL03A224MQ3NNNC
F1 = CMP-05590-000001-1: FUSE BOARD MOUNT 2A 32VDC 0402; Manufacturer: Panasonic Electronic Components; Resistance: 53mΩ; Value: 53mΩ; Voltage Rating: 32V; Fuse Interrupt Dc Current: 35A; Fuse Blow Speed: Fast; Digikey Description: FUSE BOARD MOUNT 2A 32VDC 0402; ComponentLink2Description: Datasheet; Fuse Current: 2A; Device Class L2: Fuses; Category: Fuse; Octopart: https://octopart.com/erb-rd2r00x-panasonic-21220532; RoHS: TRUE; Device Class L1: Circuit Protection; Temperature Range High: +125°C; Height: 0.49mm; Device Class L3: unset; Max Fuse Dc Voltage: 32V; Automotive: No; Manufacturer Part Number: ERB-RD2R00X; Lead Free: Yes; Temperature Range Low: -40°C; Mouser Description: Surface Mount Fuses 2A 0402 micro chip; ComponentLink2URL: https://industrial.panasonic.com/cdbs/www-data/pdf/AFA0000/AFA0000C7.pdf; Temperature: -40°C to +125°C; Package: ERBRD
L1 = CMP-14484-000037-2: SMD Power Inductors 4.7uH ±20% 2.7A 40.3mΩ; Max DC Current: 3A; Shielding: Shielded; Core Material: Ferrite; Test Frequency: 100kHz; Self Resonant Frequency: 39MHz; DC Resistance (DCR): 40.3mR; Package Quantity: 2000; Mount: Surface Mount; Max Operating Temperature: 120°C; Min Operating Temperature: -25°C; Series: NR; Case/Package: 2424; Depth: 6.2mm; Inductance Tolerance: 20%; Halogen Free: Halogen Free; Inductance: 4.7uH; Tolerance: 20%; RoHS Compliant: Yes; Width: 0.236inch; Length: 0.236inch; Lead Free: Lead Free; Radiation Hardening: No; Packaging: Tape and Reel; Number of Pins: 2; Saturation Current: 2.7A; Current Rating: 3A; Height - Seated (Max): 0.11inch; RMS Current (Irms): 3A; Termination: SMD/SMT; Height: 2.8mm; Resistor Type: Wirewound
Q6 = CMP-83955-000006-1: MOSFET N-CH 30V 5.7A SOT23; Input Capacitance: 630pF; Number of Elements: 1; Rds On Max: 26.5mR; Max Power Dissipation: 1.4W; Gate to Source Voltage (Vgs): 12V; Min Operating Temperature: -55°C; Lead Free: Lead Free; Number of Pins: 3; Drain to Source Voltage (Vdss): 30V; Case/Package: SOT-23; Mount: Surface Mount; Continuous Drain Current (ID): 5.7A; Radiation Hardening: No; Packaging: Tape and Reel; Max Operating Temperature: 150°C; Power Dissipation: 1.4W
R19 R21 R38 R39 R41-R43 R45 = CMP-1010-00755-1: 1M 0.05W 1% 0201 (0603 Metric)  SMD; Case-Metric: 0603; Value: 1000000.00 Ohm; Case-EIA: 0201; Technology: SMT; Tolerance: 1 %; Power: 0.05 W
R40 = CMP-1010-00755-1: 0402WGF4703TCE; Tolerance: 1 %; Case-Metric: 0603; Value: 1000000.00 Ohm; Case-EIA: 0201; Power: 0.05 W; Technology: SMT
U1 = CMP-12757-000010-1: IC REG BUCK ADJUSTABLE 2A TSOT26; Manufacturer: Diodes Inc.; Manufacturer Part Number: AP63200WU-7; Switching Frequency: 500kHz; Max Supply Voltage: 32V; Number Of Outputs: 1; Nominal Supply Current: 22uA; Min Supply Voltage: 3.8V; Output Type: AdjustableProgrammable; Max Junction Temp: +160°C; Standoff Height: 0.01mm; Octopart: https://octopart.com/ap63200wu-7-diodes+inc.-98099548; Height: 1mm; Temperature Range Low: -40°C; Output Current: 2A; ComponentLink2URL: https://www.diodes.com/assets/Datasheets/AP63200-AP63201-AP63203-AP63205.pdf; Switching Topology: Buck; Automotive: No; Device Class L1: Integrated Circuits (ICs); Ipc Land Pattern Name: SOT95P280X100-6; Package: TSOT26; Temperature Range High: +85°C; RoHS: TRUE; Ambient Temperature Range High: +85°C; Device Class L3: Voltage Regulators - Switching; Temperature: -40°C to +85°C; Device Class L2: Power Management ICs; Footprint Url: https://www.diodes.com/assets/Package-Files/TSOT26.pdf; Mouser Description: AP63200 Series 1.2 V 2 A Adjustable Synchronous Buck Converter - TSOT-26; Category: IC; ComponentLink2Description: Datasheet; Digikey Description: IC REG BUCK ADJUSTABLE 2A TSOT26; Lead Free: Yes; Ambient Temperature Range Low: -40°C
U2 = TPS259474ARPWR: No Description Available; Mfr_Name: Texas Instruments; Type: DEV; RefDes: RefDes; Copyright: Copyright (C) 2021 Ultra Librarian. All rights reserved.; Manufacturer_Part_Number: TPS259474ARPWR; Digi-Key_Part_Number_1: 296-TPS259474ARPWRCT-ND; Digi-Key_Part_Number_2: 296-TPS259474ARPWRDKR-ND; Digi-Key_Part_Number_3: 296-TPS259474ARPWRTR-ND; Supplier 1: Digi-Key; Supplier Part Number 1: 296-TPS259472ARPWRDKR-ND

## Sheet MXM 3.1 Connector Interface.SchDoc
size Tabloid; DrawnBy: Krutav Shah; SheetNumber: 4; SheetTotal: 6
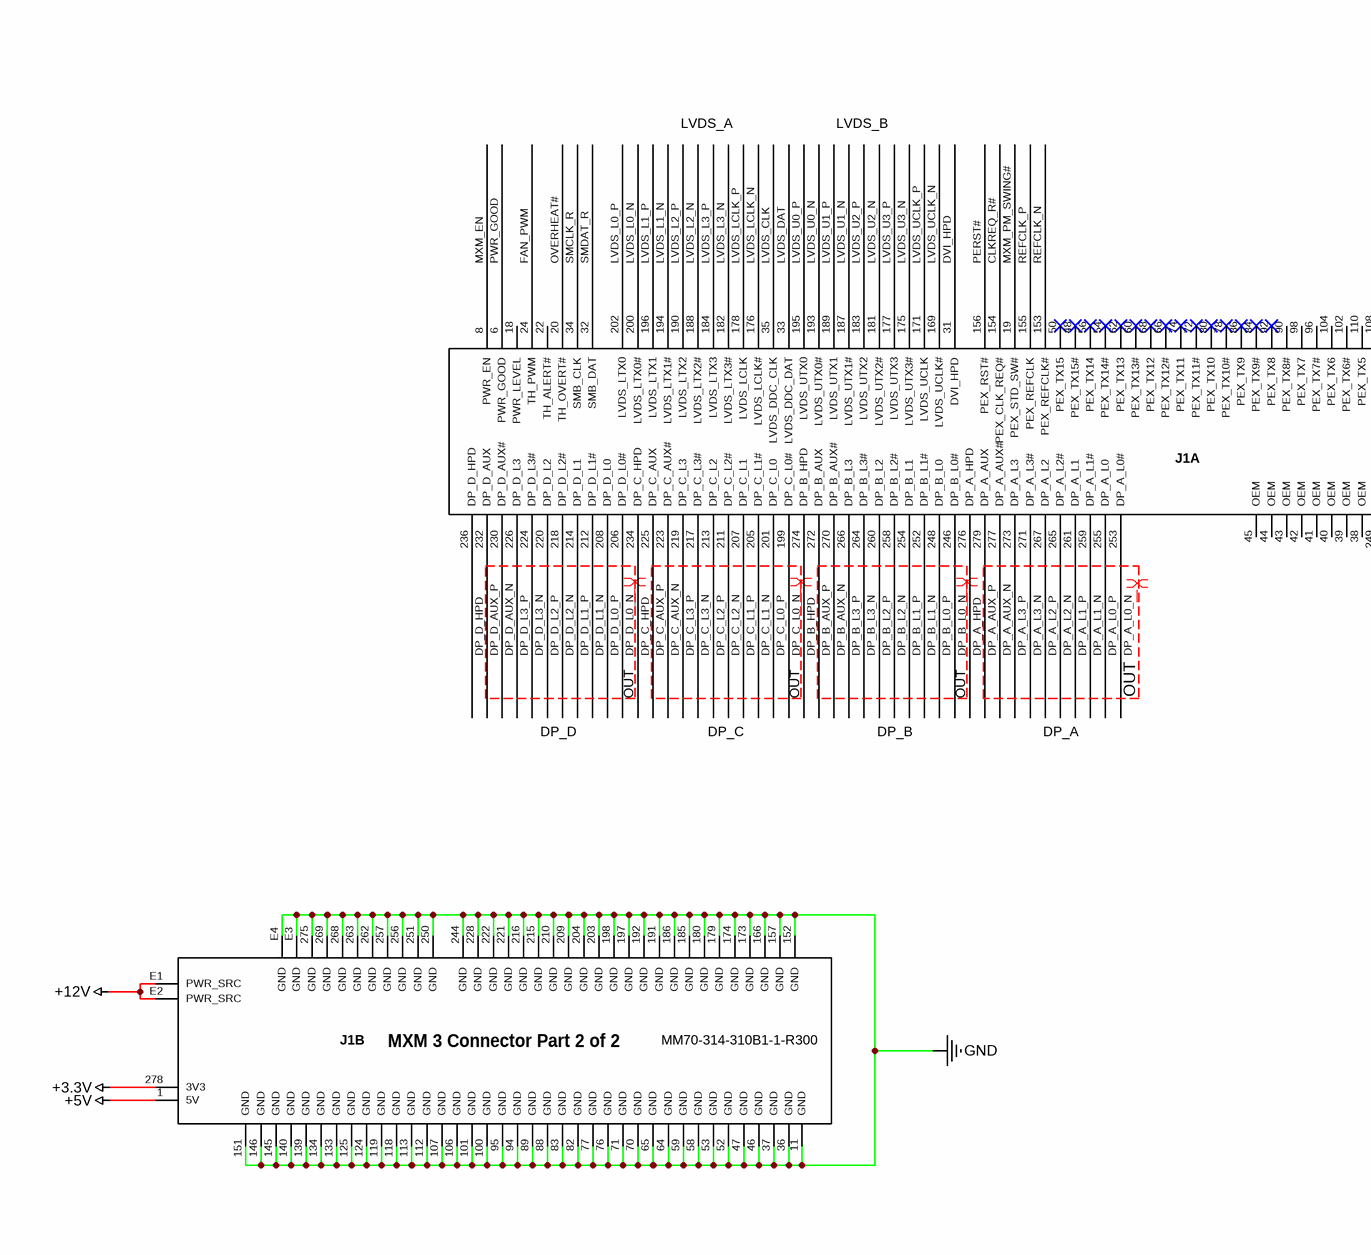
[diagram p5: MXM 3.1 Connector Interface.SchDoc, left]
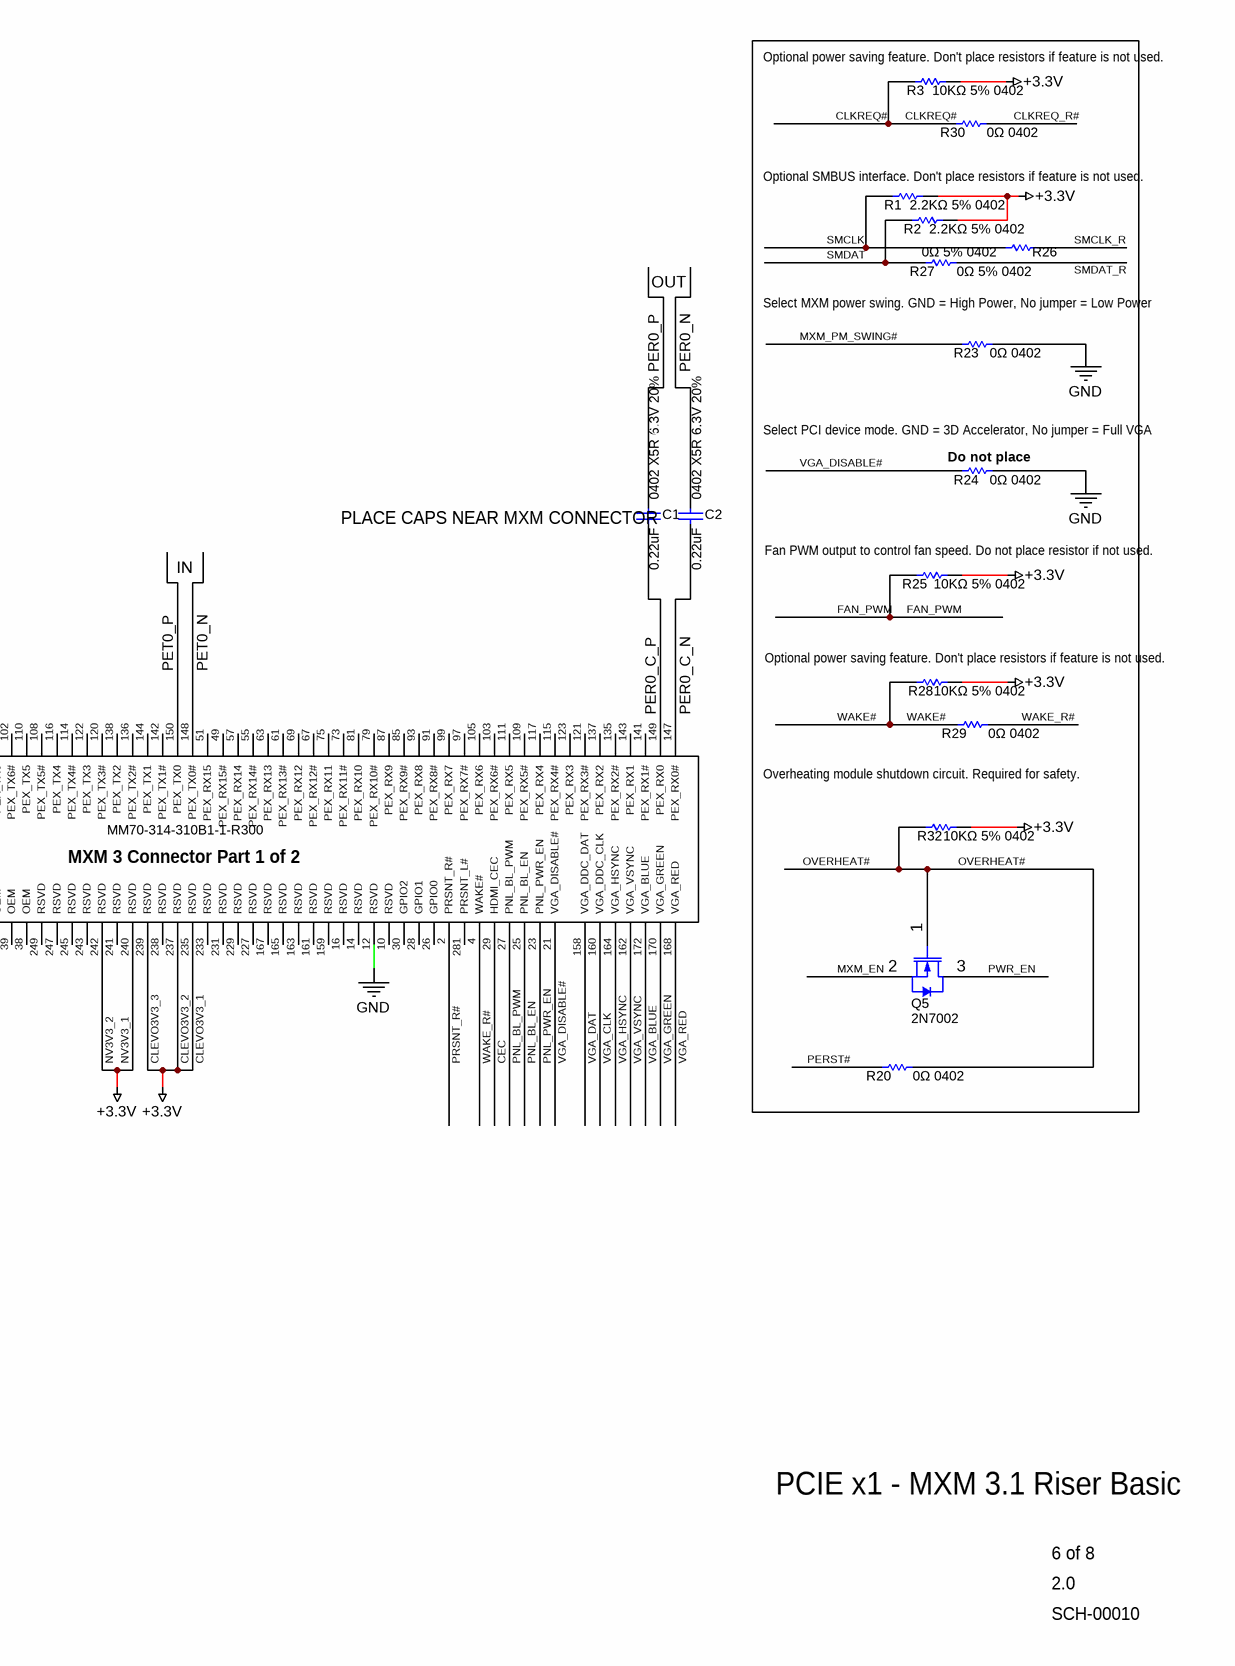
[diagram p6: MXM 3.1 Connector Interface.SchDoc, right]

### Parts
C1  0.22uF       0402 X5R 6.3V 20%  [CAPC0603X33X15NL03T05]
C2  0.22uF       0402 X5R 6.3V 20%  [CAPC0603X33X15NL03T05]
J1  MM70-314-310B1-1-R300  [JAE_MM70-314-310B1-2-R300]  (parts A,B of 2)
Q5  2N7002  [INF-PG-SOT23_M]
R1  2.2KΩ 5% 0402  [RESC0201(0603)_L]
R2  2.2KΩ 5% 0402  [RESC0201(0603)_L]
R3  10KΩ 5% 0402  [RESC0201(0603)_L]
R20  0Ω 0402  [RESC0201(0603)_L]
R23  0Ω 0402  [RESC0201(0603)_L]
R24  0Ω 0402  [RESC0201(0603)_L]
R25  10KΩ 5% 0402  [RESC0201(0603)_L]
R26  0Ω 5% 0402  [RESC0201(0603)_L]
R27  0Ω 5% 0402  [RESC0201(0603)_L]
R28  10KΩ 5% 0402  [RESC0201(0603)_L]
R29  0Ω 0402  [RESC0201(0603)_L]
R30  0Ω 0402  [RESC0201(0603)_L]
R32  10KΩ 5% 0402  [RESC0201(0603)_L]

### Nets
+3.3V: J1.235(RSVD) J1.237(RSVD) J1.239(RSVD) J1.240(RSVD) J1.242(RSVD) J1.278(3V3) R1.1 R2.1 R3.1 R25.1 R28.1 R32.1  [also labelled CLEVO3V3_1, CLEVO3V3_2, CLEVO3V3_3, NV3V3_1, NV3V3_2]
+5V: J1.1(5V)
+12V: J1.E1(PWR_SRC) J1.E2(PWR_SRC)
GND: J1.11(GND) J1.12(RSVD) J1.36(GND) J1.37(GND) J1.46(GND) J1.47(GND) J1.52(GND) J1.53(GND) J1.58(GND) J1.59(GND) J1.64(GND) J1.65(GND) J1.70(GND) J1.71(GND) J1.76(GND) J1.77(GND) J1.82(GND) J1.83(GND) J1.88(GND) J1.89(GND) J1.94(GND) J1.95(GND) J1.100(GND) J1.101(GND) J1.106(GND) J1.107(GND) J1.112(GND) J1.113(GND) J1.118(GND) J1.119(GND) J1.124(GND) J1.125(GND) J1.133(GND) J1.134(GND) J1.139(GND) J1.140(GND) J1.145(GND) J1.146(GND) J1.151(GND) J1.152(GND) J1.157(GND) J1.166(GND) J1.173(GND) J1.174(GND) J1.179(GND) J1.180(GND) J1.185(GND) J1.186(GND) J1.191(GND) J1.192(GND) J1.197(GND) J1.198(GND) J1.203(GND) J1.204(GND) J1.209(GND) J1.210(GND) J1.215(GND) J1.216(GND) J1.221(GND) J1.222(GND) J1.228(GND) J1.244(GND) J1.250(GND) J1.251(GND) J1.256(GND) J1.257(GND) J1.262(GND) J1.263(GND) J1.268(GND) J1.269(GND) J1.275(GND) J1.E3(GND) J1.E4(GND) R23.1 R24.1
CEC: J1.29(HDMI_CEC)
CLKREQ#: R3.2 R30.2
CLKREQ_R#: J1.154(PEX_CLK_REQ#) R30.1
DP_A_AUX_N: J1.277(DP_A_AUX#)
DP_A_AUX_P: J1.279(DP_A_AUX)
DP_A_HPD: J1.276(DP_A_HPD)
DP_A_L0_N: J1.253(DP_A_L0#)
DP_A_L0_P: J1.255(DP_A_L0)
DP_A_L1_N: J1.259(DP_A_L1#)
DP_A_L1_P: J1.261(DP_A_L1)
DP_A_L2_N: J1.265(DP_A_L2#)
DP_A_L2_P: J1.267(DP_A_L2)
DP_A_L3_N: J1.271(DP_A_L3#)
DP_A_L3_P: J1.273(DP_A_L3)
DP_B_AUX_N: J1.270(DP_B_AUX#)
DP_B_AUX_P: J1.272(DP_B_AUX)
DP_B_HPD: J1.274(DP_B_HPD)
DP_B_L0_N: J1.246(DP_B_L0#)
DP_B_L0_P: J1.248(DP_B_L0)
DP_B_L1_N: J1.252(DP_B_L1#)
DP_B_L1_P: J1.254(DP_B_L1)
DP_B_L2_N: J1.258(DP_B_L2#)
DP_B_L2_P: J1.260(DP_B_L2)
DP_B_L3_N: J1.264(DP_B_L3#)
DP_B_L3_P: J1.266(DP_B_L3)
DP_C_AUX_N: J1.223(DP_C_AUX#)
DP_C_AUX_P: J1.225(DP_C_AUX)
DP_C_HPD: J1.234(DP_C_HPD)
DP_C_L0_N: J1.199(DP_C_L0#)
DP_C_L0_P: J1.201(DP_C_L0)
DP_C_L1_N: J1.205(DP_C_L1#)
DP_C_L1_P: J1.207(DP_C_L1)
DP_C_L2_N: J1.211(DP_C_L2#)
DP_C_L2_P: J1.213(DP_C_L2)
DP_C_L3_N: J1.217(DP_C_L3#)
DP_C_L3_P: J1.219(DP_C_L3)
DP_D_AUX_N: J1.230(DP_D_AUX#)
DP_D_AUX_P: J1.232(DP_D_AUX)
DP_D_HPD: J1.236(DP_D_HPD)
DP_D_L0_N: J1.206(DP_D_L0#)
DP_D_L0_P: J1.208(DP_D_L0)
DP_D_L1_N: J1.212(DP_D_L1#)
DP_D_L1_P: J1.214(DP_D_L1)
DP_D_L2_N: J1.218(DP_D_L2#)
DP_D_L2_P: J1.220(DP_D_L2)
DP_D_L3_N: J1.224(DP_D_L3#)
DP_D_L3_P: J1.226(DP_D_L3)
DVI_HPD: J1.31(DVI_HPD)
FAN_PWM: J1.24(TH_PWM) R25.2
LVDS_CLK: J1.35(LVDS_DDC_CLK)
LVDS_DAT: J1.33(LVDS_DDC_DAT)
LVDS_L0_N: J1.200(LVDS_LTX0#)
LVDS_L0_P: J1.202(LVDS_LTX0)
LVDS_L1_N: J1.194(LVDS_LTX1#)
LVDS_L1_P: J1.196(LVDS_LTX1)
LVDS_L2_N: J1.188(LVDS_LTX2#)
LVDS_L2_P: J1.190(LVDS_LTX2)
LVDS_L3_N: J1.182(LVDS_LTX3#)
LVDS_L3_P: J1.184(LVDS_LTX3)
LVDS_LCLK_N: J1.176(LVDS_LCLK#)
LVDS_LCLK_P: J1.178(LVDS_LCLK)
LVDS_U0_N: J1.193(LVDS_UTX0#)
LVDS_U0_P: J1.195(LVDS_UTX0)
LVDS_U1_N: J1.187(LVDS_UTX1#)
LVDS_U1_P: J1.189(LVDS_UTX1)
LVDS_U2_N: J1.181(LVDS_UTX2#)
LVDS_U2_P: J1.183(LVDS_UTX2)
LVDS_U3_N: J1.175(LVDS_UTX3#)
LVDS_U3_P: J1.177(LVDS_UTX3)
LVDS_UCLK_N: J1.169(LVDS_UCLK#)
LVDS_UCLK_P: J1.171(LVDS_UCLK)
MXM_EN: J1.8(PWR_EN) Q5.2(SOURCE)
MXM_PM_SWING#: J1.19(PEX_STD_SW#) R23.2
OVERHEAT#: J1.20(TH_OVERT#) Q5.1(GATE) R20.1 R32.2
PER0_C_N: C2.1 J1.147(PEX_RX0#)
PER0_C_P: C1.1 J1.149(PEX_RX0)
PER0_N: C2.2
PER0_P: C1.2
PERST#: J1.156(PEX_RST#) R20.2
PET0_N: J1.148(PEX_TX0#)
PET0_P: J1.150(PEX_TX0)
PNL_BL_EN: J1.25(PNL_BL_EN)
PNL_BL_PWM: J1.27(PNL_BL_PWM)
PNL_PWR_EN: J1.23(PNL_PWR_EN)
PRSNT_R#: J1.2(PRSNT_R#)
PWR_EN: Q5.3(DRAIN)
PWR_GOOD: J1.6(PWR_GOOD)
REFCLK_N: J1.153(PEX_REFCLK#)
REFCLK_P: J1.155(PEX_REFCLK)
SMCLK: R1.2 R26.2
SMCLK_R: J1.34(SMB_CLK) R26.1
SMDAT: R2.2 R27.2
SMDAT_R: J1.32(SMB_DAT) R27.1
VGA_BLUE: J1.172(VGA_BLUE)
VGA_CLK: J1.160(VGA_DDC_CLK)
VGA_DAT: J1.158(VGA_DDC_DAT)
VGA_DISABLE#: J1.21(VGA_DISABLE#) R24.2
VGA_GREEN: J1.170(VGA_GREEN)
VGA_HSYNC: J1.164(VGA_HSYNC)
VGA_RED: J1.168(VGA_RED)
VGA_VSYNC: J1.162(VGA_VSYNC)
WAKE#: R28.2 R29.2
WAKE_R#: J1.4(WAKE#) R29.1

Not connected (* = marked no-connect by the designer): J1 10(RSVD) 14(RSVD) 16(RSVD) 18(PWR_LEVEL) 22(TH_ALERT#) 26(GPIO0) 28(GPIO1) 30(GPIO2) 38(OEM) 39(OEM) 40(OEM) 41(OEM) 42(OEM) 43(OEM) 44(OEM) 45(OEM) 48(PEX_TX15#)* 49(PEX_RX15#) 50(PEX_TX15)* 51(PEX_RX15) 54(PEX_TX14#)* 55(PEX_RX14#) 56(PEX_TX14)* 57(PEX_RX14) 60(PEX_TX13#)* 61(PEX_RX13#) 62(PEX_TX13)* 63(PEX_RX13) 66(PEX_TX12#)* 67(PEX_RX12#) 68(PEX_TX12)* 69(PEX_RX12) 72(PEX_TX11#)* 73(PEX_RX11#) 74(PEX_TX11)* 75(PEX_RX11) 78(PEX_TX10#)* 79(PEX_RX10#) 80(PEX_TX10)* 81(PEX_RX10) 84(PEX_TX9#)* 85(PEX_RX9#) 86(PEX_TX9)* 87(PEX_RX9) 90(PEX_TX8#) 91(PEX_RX8#) 92(PEX_TX8)* 93(PEX_RX8) 96(PEX_TX7#) 97(PEX_RX7#) 98(PEX_TX7) 99(PEX_RX7) 102(PEX_TX6#) 103(PEX_RX6#) 104(PEX_TX6) 105(PEX_RX6) 108(PEX_TX5#) 109(PEX_RX5#) 110(PEX_TX5) 111(PEX_RX5) 114(PEX_TX4#) 115(PEX_RX4#) 116(PEX_TX4) 117(PEX_RX4) 120(PEX_TX3#) 121(PEX_RX3#) 122(PEX_TX3) 123(PEX_RX3) 135(PEX_RX2#) 136(PEX_TX2#) 137(PEX_RX2) 138(PEX_TX2) 141(PEX_RX1#) 142(PEX_TX1#) 143(PEX_RX1) 144(PEX_TX1) 159(RSVD) 161(RSVD) 163(RSVD) 165(RSVD) 167(RSVD) 227(RSVD) 229(RSVD) 231(RSVD) 233(RSVD) 238(RSVD) 241(RSVD) 243(RSVD) 245(RSVD) 247(RSVD) 249(RSVD) 281(PRSNT_L#)

### Layout directives
differential pair: DP_A_AUX_N, DP_A_AUX_P, DP_A_L0_N, DP_A_L0_P, DP_A_L1_N, DP_A_L1_P, DP_A_L2_N, DP_A_L2_P, DP_A_L3_N, DP_A_L3_P, DP_B_AUX_N, DP_B_AUX_P, DP_B_L0_N, DP_B_L0_P, DP_B_L1_N, DP_B_L1_P, DP_B_L2_N, DP_B_L2_P, DP_B_L3_N, DP_B_L3_P, DP_C_AUX_N, DP_C_AUX_P, DP_C_L0_N, DP_C_L0_P, DP_C_L1_N, DP_C_L1_P, DP_C_L2_N, DP_C_L2_P, DP_C_L3_N, DP_C_L3_P, DP_D_AUX_N, DP_D_AUX_P, DP_D_L0_N, DP_D_L0_P, DP_D_L1_N, DP_D_L1_P, DP_D_L2_N, DP_D_L2_P, DP_D_L3_N, DP_D_L3_P, LVDS_L0_N, LVDS_L0_P, LVDS_L1_N, LVDS_L1_P, LVDS_L2_N, LVDS_L2_P, LVDS_L3_N, LVDS_L3_P, LVDS_LCLK_N, LVDS_LCLK_P, LVDS_U0_N, LVDS_U0_P, LVDS_U1_N, LVDS_U1_P, LVDS_U2_N, LVDS_U2_P, LVDS_U3_N, LVDS_U3_P, LVDS_UCLK_N, LVDS_UCLK_P, PER0_C_N, PER0_C_P, PER0_N, PER0_P, PET0_N, PET0_P, REFCLK_N, REFCLK_P

### Notes on the sheet
- (near R3) Optional power saving feature. Don't place resistors if feature is not used.
- (near R1) Optional SMBUS interface. Don't place resistors if feature is not used.
- OUT
- Select MXM power swing. GND = High Power, No jumper = Low Power
- (near R24) Select PCI device mode. GND = 3D Accelerator, No jumper = Full VGA
- (near R24) Do not place
- LVDS_A
- LVDS_B
- (near C1) PLACE CAPS NEAR MXM CONNECTOR
- (near R25) Fan PWM output to control fan speed. Do not place resistor if not used.
- IN
- (near R28) Optional power saving feature. Don't place resistors if feature is not used.
- Overheating module shutdown circuit. Required for safety.
- DP_D
- DP_C
- DP_B
- DP_A
- PCIE x1 - MXM 3.1 Riser Basic
- 6 of 8
- 2.0
- SCH-00010
- Last Modified:
- Krutav.com
- The Krutav Shah Company
- US-Tabloid
- SIZE:
- SHEET:
- This document and its contents are the property of The Krutav Shah Company. The posessor of this document agrees to the following:
- Proprietary Property Notice:
- 1. Do not distrubte without authorization.
- 3. Use for the purposes of evaluation only.
- 2. Not to reproduce or copy the contents of.
- 4. The Krutav Shah Company reserves all rights.
- Revision:
- Inventory #:
- (in symbol MM70-314-310B1-1-R300, part A) MXM 3 Connector Part 1 of 2
- (in symbol MM70-314-310B1-1-R300, part B) MXM 3 Connector Part 2 of 2

### Library data of the parts
C1 C2 = CMP-2010-00679-1: as C29 on sheet Power Sources and Supply
J1 = MM70-314-310B1-1-R300: 314 Position Female Connector MXM 3.0 Gold 0.020 _0.50mm_ Black; MF: JAE Electronics; Package: None; Digi-Key_Part_Number: 670-2431-1-ND; Digi-Key_Purchase_URL: https://www.digikey.com/product-detail/en/jae-electronics/MM70-314-310B1-1-R300/670-2431-1-ND/2183605?utm_source=snapeda&utm_medium=aggregator&utm_campaign=symbol; Value: *; MP: MM70-314-310B1-1-R300; SnapEDA_Link: https://www.snapeda.com/parts/MM70-314-310B1-1-R300/JAE%20Electronics/view-part/553386/?ref=snap
Q5 = CMP-1149-00026-1: N-Channel OptiMOS Small-Signal-Transistor, 60 V VDS, 0.3 A ID, -55 to 150 degC, PG-SOT23, Reel, Green; Manufacturer: Infineon; RDS (on) (max) (@4.5V): 4,000 mOhm; VDS (max): 60 V; IDpuls (max): 1.2Â A; QG: 0.4Â nC; RDS (on) (max): 3,000 mOhm; RthJA (max): 250 K/W; ID (max): 0.3Â A; VGS(th) (max): 2.5Â V; VGS(th) (min): 1.5Â V; Green: TRUE; Ptot (max): 0.5Â W; PackageDescription: 3-Pin Small Outline Transistor Package, 2.9 x 1.3 mm Body, 0.95 mm Pitch; Halogen-free: TRUE; ComponentLink2Description: Datasheet; ComponentLink1URL: http://www.infineon.com/; Packing: Reel; DatasheetVersion: Rev. 2.4; PartNumber: 2N7002; PackageReference: PG-SOT23; PackageVersion: Apr-08; ComponentLink3URL: http://www.infineon.com/dgdl/SOT23-Package_Overview.pdf?folderId=db3a30431936bc4b0119532290053c66&fileId=db3a30431936bc4b0119533468123c85; ComponentLink1Description: Manufacturer URL; Mounting Technology: Surface Mount; ComponentLink3Description: Package Specification; ComponentLink2URL: http://www.infineon.com/dgdl/2N7002_Rev2.4.pdf?folderId=db3a3043156fd573011622e10b5c1f67&fileId=db3a304319bc939a0119c2a9461e79e6
R1-R3 R20 R23-R30 R32 = CMP-1010-00755-1: as R19 on sheet Power Sources and Supply; Technology: SMT; Tolerance: 1 %; Power: 0.05 W

## Sheet Display Interface.SchDoc
size Tabloid; DrawnBy: Krutav Shah; SheetNumber: 6; SheetTotal: 7
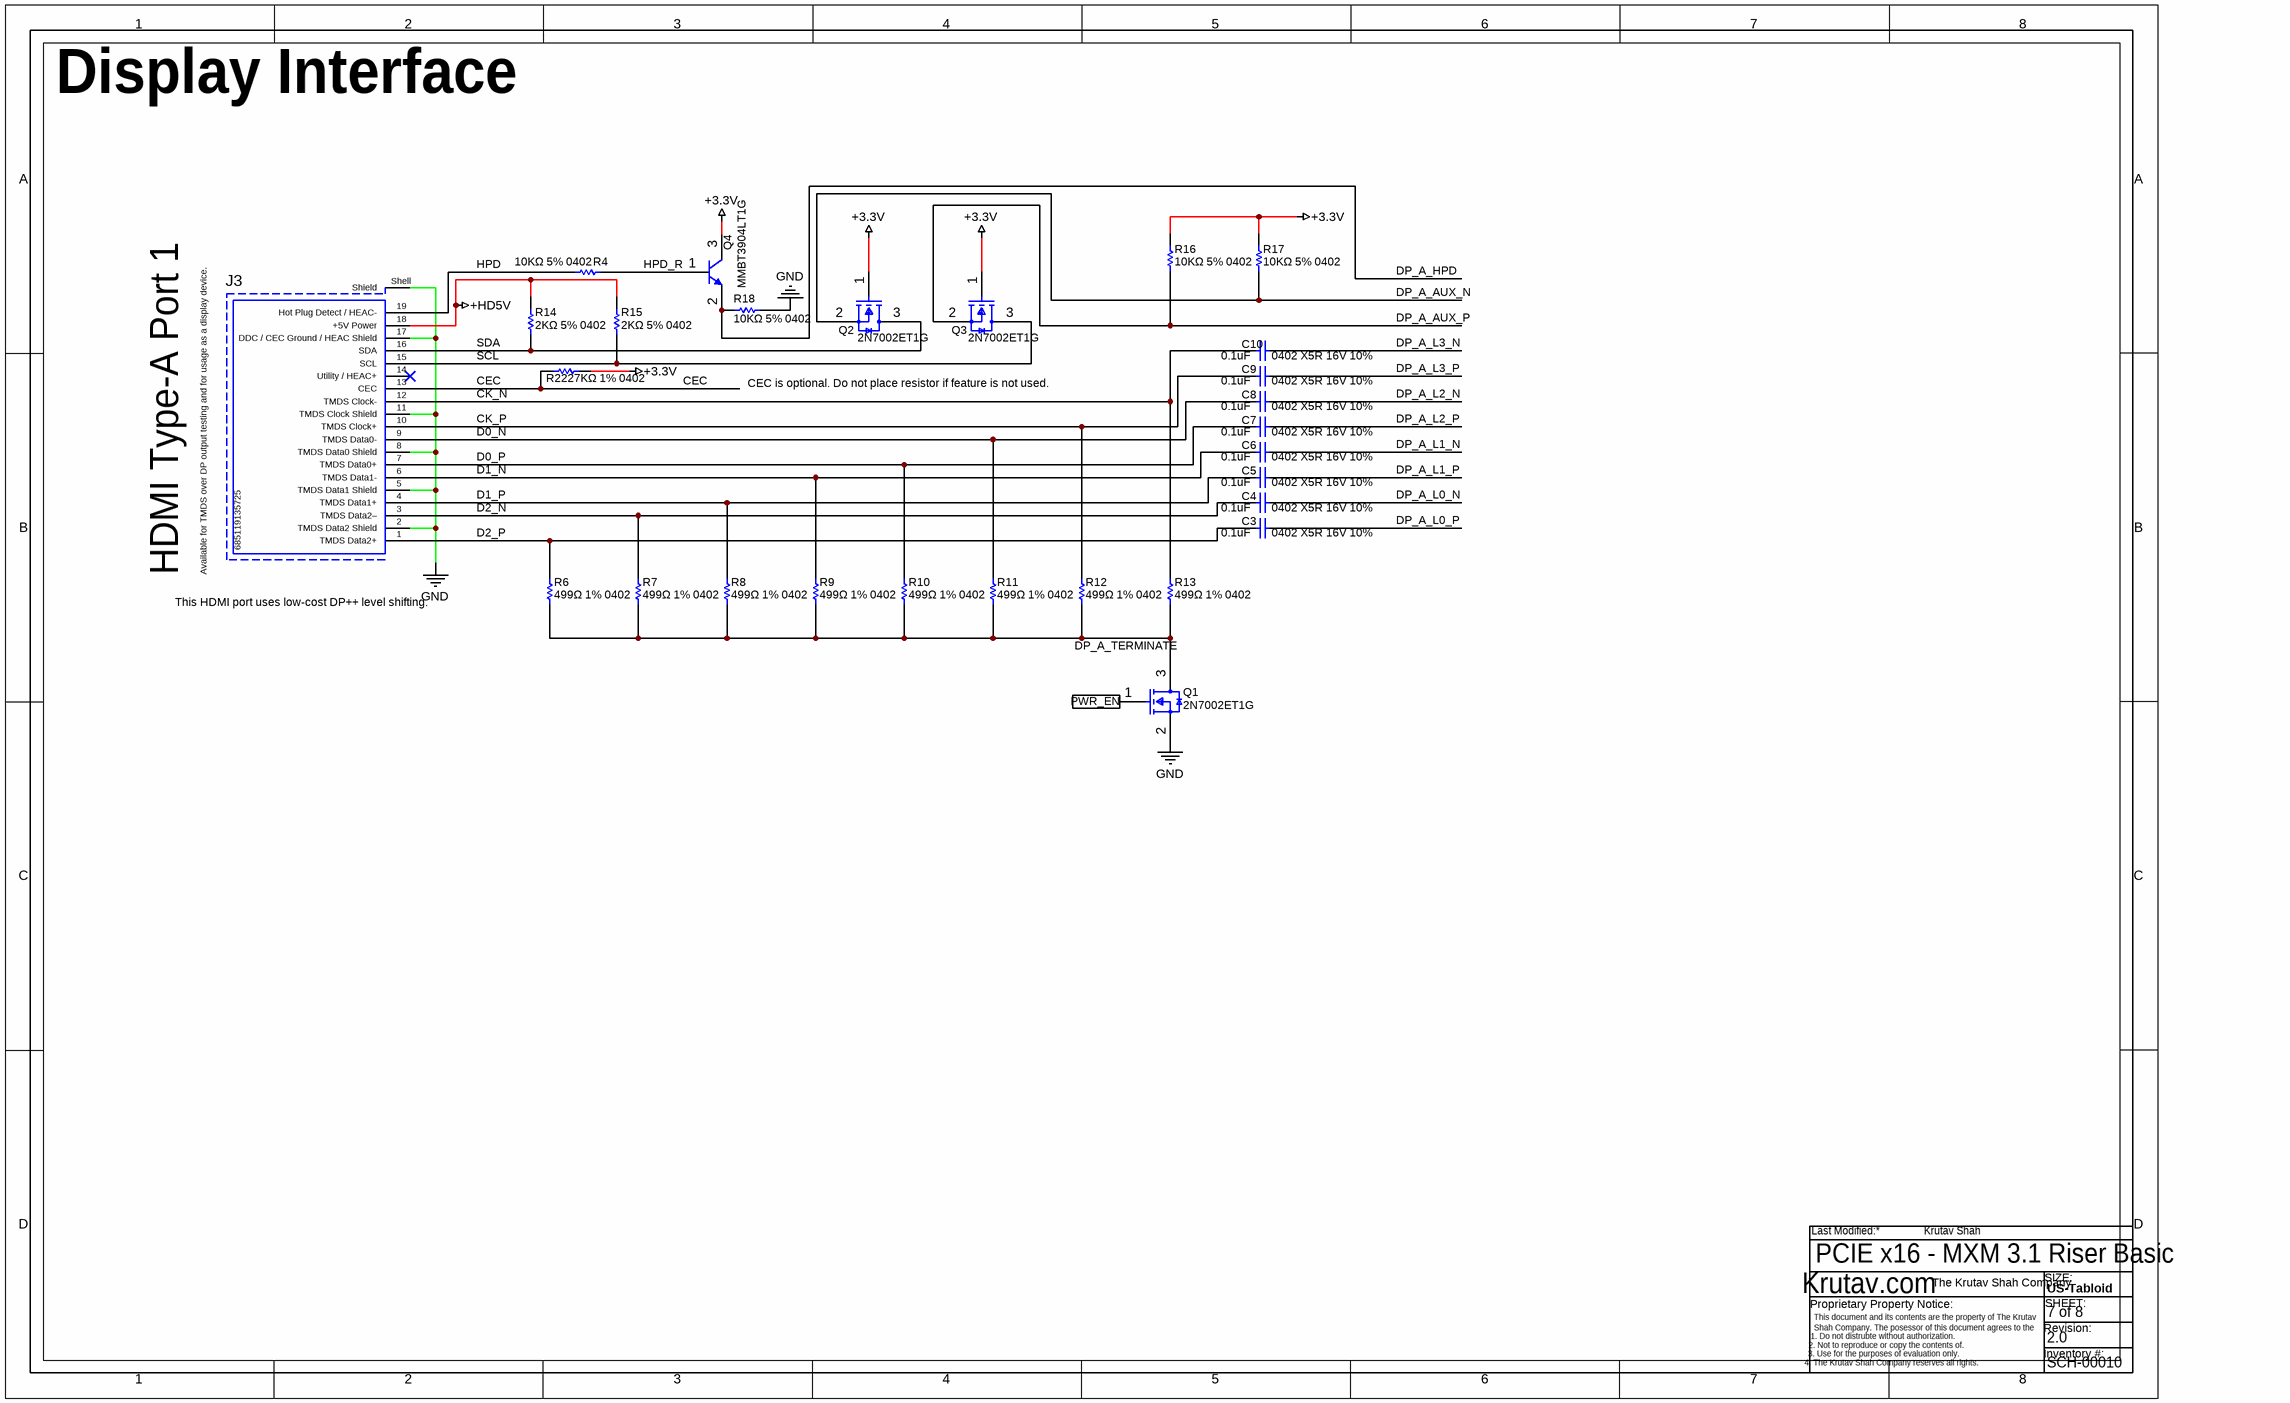
[diagram p7: Display Interface.SchDoc]

### Parts
C3  0.1uF       0402 X5R 16V 10%  [CAPC0603X33X15NL03T05]
C4  0.1uF       0402 X5R 16V 10%  [CAPC0603X33X15NL03T05]
C5  0.1uF       0402 X5R 16V 10%  [CAPC0603X33X15NL03T05]
C6  0.1uF       0402 X5R 16V 10%  [CAPC0603X33X15NL03T05]
C7  0.1uF       0402 X5R 16V 10%  [CAPC0603X33X15NL03T05]
C8  0.1uF       0402 X5R 16V 10%  [CAPC0603X33X15NL03T05]
C9  0.1uF       0402 X5R 16V 10%  [CAPC0603X33X15NL03T05]
C10  0.1uF       0402 X5R 16V 10%  [CAPC0603X33X15NL03T05]
J3  685119135725  [685119135725]
Q1  2N7002ET1G  [FP-318-08-IPC_A]
Q2  2N7002ET1G  [FP-318-08-IPC_A]
Q3  2N7002ET1G  [FP-318-08-IPC_A]
Q4  MMBT3904LT1G  [ONSC-SOT-23-3-318-08_V]
R4  10KΩ 5% 0402  [RESC0201(0603)_L]
R6  499Ω 1% 0402  [RESC0201(0603)_L]
R7  499Ω 1% 0402  [RESC0201(0603)_L]
R8  499Ω 1% 0402  [RESC0201(0603)_L]
R9  499Ω 1% 0402  [RESC0201(0603)_L]
R10  499Ω 1% 0402  [RESC0201(0603)_L]
R11  499Ω 1% 0402  [RESC0201(0603)_L]
R12  499Ω 1% 0402  [RESC0201(0603)_L]
R13  499Ω 1% 0402  [RESC0201(0603)_L]
R14  2KΩ 5% 0402  [RESC0201(0603)_L]
R15  2KΩ 5% 0402  [RESC0201(0603)_L]
R16  10KΩ 5% 0402  [RESC0201(0603)_L]
R17  10KΩ 5% 0402  [RESC0201(0603)_L]
R18  10KΩ 5% 0402  [RESC0201(0603)_L]
R22  27KΩ 1% 0402  [RESC0201(0603)_L]

### Ports
PWR_EN

### Nets
+3.3V: Q2.1(Gate) Q3.1(Gate) Q4.3(C) R16.1 R17.1 R22.1
+HD5V: J3.18(+5V_Power) R14.1 R15.1
GND: J3.2(TMDS_Data2_Shield) J3.5(TMDS_Data1_Shield) J3.8(TMDS_Data0_Shield) J3.11(TMDS_Clock_Shield) J3.17(DDC_/_CEC_Ground_/_HEAC_Shield) J3.Shell(Shield) Q1.2(Source) R18.2
CEC: J3.13(CEC) R22.2
CK_N: C10.1 J3.12(TMDS_Clock-) R13.1
CK_P: C9.1 J3.10(TMDS_Clock+) R12.1
D0_N: C8.1 J3.9(TMDS_Data0-) R11.1
D0_P: C7.1 J3.7(TMDS_Data0+) R10.1
D1_N: C6.1 J3.6(TMDS_Data1-) R9.1
D1_P: C5.1 J3.4(TMDS_Data1+) R8.1
D2_N: C4.1 J3.3(TMDS_Data2–) R7.1
D2_P: C3.1 J3.1(TMDS_Data2+) R6.1
DP_A_AUX_N: Q2.2(Source) R17.2
DP_A_AUX_P: Q3.2(Source) R16.2
DP_A_HPD: Q4.2(E) R18.1
DP_A_L0_N: C4.2
DP_A_L0_P: C3.2
DP_A_L1_N: C6.2
DP_A_L1_P: C5.2
DP_A_L2_N: C8.2
DP_A_L2_P: C7.2
DP_A_L3_N: C10.2
DP_A_L3_P: C9.2
DP_A_TERMINATE: Q1.3(Drain) R6.2 R7.2 R8.2 R9.2 R10.2 R11.2 R12.2 R13.2
HPD: J3.19(Hot_Plug_Detect_/_HEAC-) R4.2
HPD_R: Q4.1(B) R4.1
PWR_EN: Q1.1(Gate) ; port PWR_EN
SCL: J3.15(SCL) Q3.3(Drain) R15.2
SDA: J3.16(SDA) Q2.3(Drain) R14.2

Not connected (* = marked no-connect by the designer): J3 14(Utility_/_HEAC+)*

### Layout directives
differential pair: CK_N, CK_P, D0_N, D0_P, D1_N, D1_P, D2_N, D2_P, DP_A_AUX_N, DP_A_AUX_P, DP_A_L0_N, DP_A_L0_P, DP_A_L1_N, DP_A_L1_P, DP_A_L2_N, DP_A_L2_P, DP_A_L3_N, DP_A_L3_P

### Notes on the sheet
- Display Interface
- CEC is optional. Do not place resistor if feature is not used.
- HDMI Type-A Port 1
- Available for TMDS over DP output testing and for usage as a display device.
- This HDMI port uses low-cost DP++ level shifting.
- PCIE x16 - MXM 3.1 Riser Basic
- 7 of 8
- 2.0
- SCH-00010
- Last Modified:
- Krutav.com
- The Krutav Shah Company
- US-Tabloid
- SIZE:
- SHEET:
- This document and its contents are the property of The Krutav Shah Company. The posessor of this document agrees to the following:
- Proprietary Property Notice:
- 1. Do not distrubte without authorization.
- 3. Use for the purposes of evaluation only.
- 2. Not to reproduce or copy the contents of.
- 4. The Krutav Shah Company reserves all rights.
- Revision:
- Inventory #:

### Library data of the parts
C3-C10 = CMP-2010-00679-1: as C29 on sheet Power Sources and Supply
J3 = CMP-1502-00170-1: HDMI Type A Receptacle WR-COM, Horizontal, SMT, with M3 Screw Flange; Manufacturer: Wurth Elektronik; Working Voltage: 40VAC; Rated Current: 0.5A; Contact Resistance: 30mOhm; Gender: Receptacle; Publisher: WurthElektronik; Connector Type: HDMITypeA; Manufacturer URL: http://www.we-online.de; Datasheet URL: https://katalog.we-online.de/em/datasheet/685119135725.pdf; Packaging: Tray; Operating Temperature: -20to85degC; Package Reference: 685119135725; Mounting Technology: SMT; Orientation: Horizontal; Part Number: 685119135725
Q1-Q3 = CMP-1058-00769-2: MOSFET N-CH 60V 260MA SOT-23; On-State Resistance: 2.5R; Turn-Off Delay Time: 4.8ns; Nominal Vgs: 1V; Element Configuration: Single; Rise Time: 1.2ns; Input Capacitance: 26.7pF; Number of Elements: 1; Turn-On Delay Time: 1.7ns; Gate to Source Voltage (Vgs): 20V; Max Power Dissipation: 300mW; Drain to Source Breakdown Voltage: 60V; Max Operating Temperature: 150°C; REACH SVHC: No SVHC; Case/Package: SOT-23-3; Lead Free: Lead Free; Length: 2.9mm; Height: 0.94mm; Package Quantity: 3000; Min Operating Temperature: -55°C; Radiation Hardening: No; Packaging: Tape and Reel; Fall Time: 1.2ns; Drain to Source Resistance: 2.5R; Halogen Free: Halogen Free; Threshold Voltage: 1V; Number of Pins: 3; Continuous Drain Current (ID): 260mA; Rds On Max: 2.5R; Power Dissipation: 300mW; Width: 1.3mm
Q4 = CMP-1048-00631-1: General Purpose Transistor, NPN Silicon, 3-Pin SOT-23, Pb-Free, Tape and Reel; Manufacturer: On Semiconductor; IC Continuous (A): 0.2; fT Min (MHz): 300; ComponentLink2Description: Datasheet; Polarity: NPN; PackageDescription: 3-Pin Small Outline Transistor, Body 2.92 x 1.3 mm, Pitch 0.95 mm; ComponentLink2URL: http://www.onsemi.cn/pub_link/Collateral/MMBT3904LT1-D.PDF; DatasheetVersion: Rev. 12; Mounting Technology: Surface Mount; PartNumber: MMBT3904LT1G; ComponentLink1URL: http://www.onsemi.com/; ComponentLink3Description: Package Specification; ComponentLink1Description: Manufacturer URL; PackageVersion: Rev. AP, 11/2009; PackageReference: SOT-23-3-318-08; Packing: Tape and Reel; ComponentLink3URL: http://www.onsemi.cn/pub_link/Collateral/318-08.PDF; RoHS: TRUE
R4 R6-R18 R22 = CMP-1010-00755-1: as R19 on sheet Power Sources and Supply; Technology: SMT; Tolerance: 1 %; Power: 0.05 W

## Sheet Miscellaneous.SchDoc
size Tabloid; DrawnBy: Krutav Shah; SheetNumber: 4; SheetTotal: 6
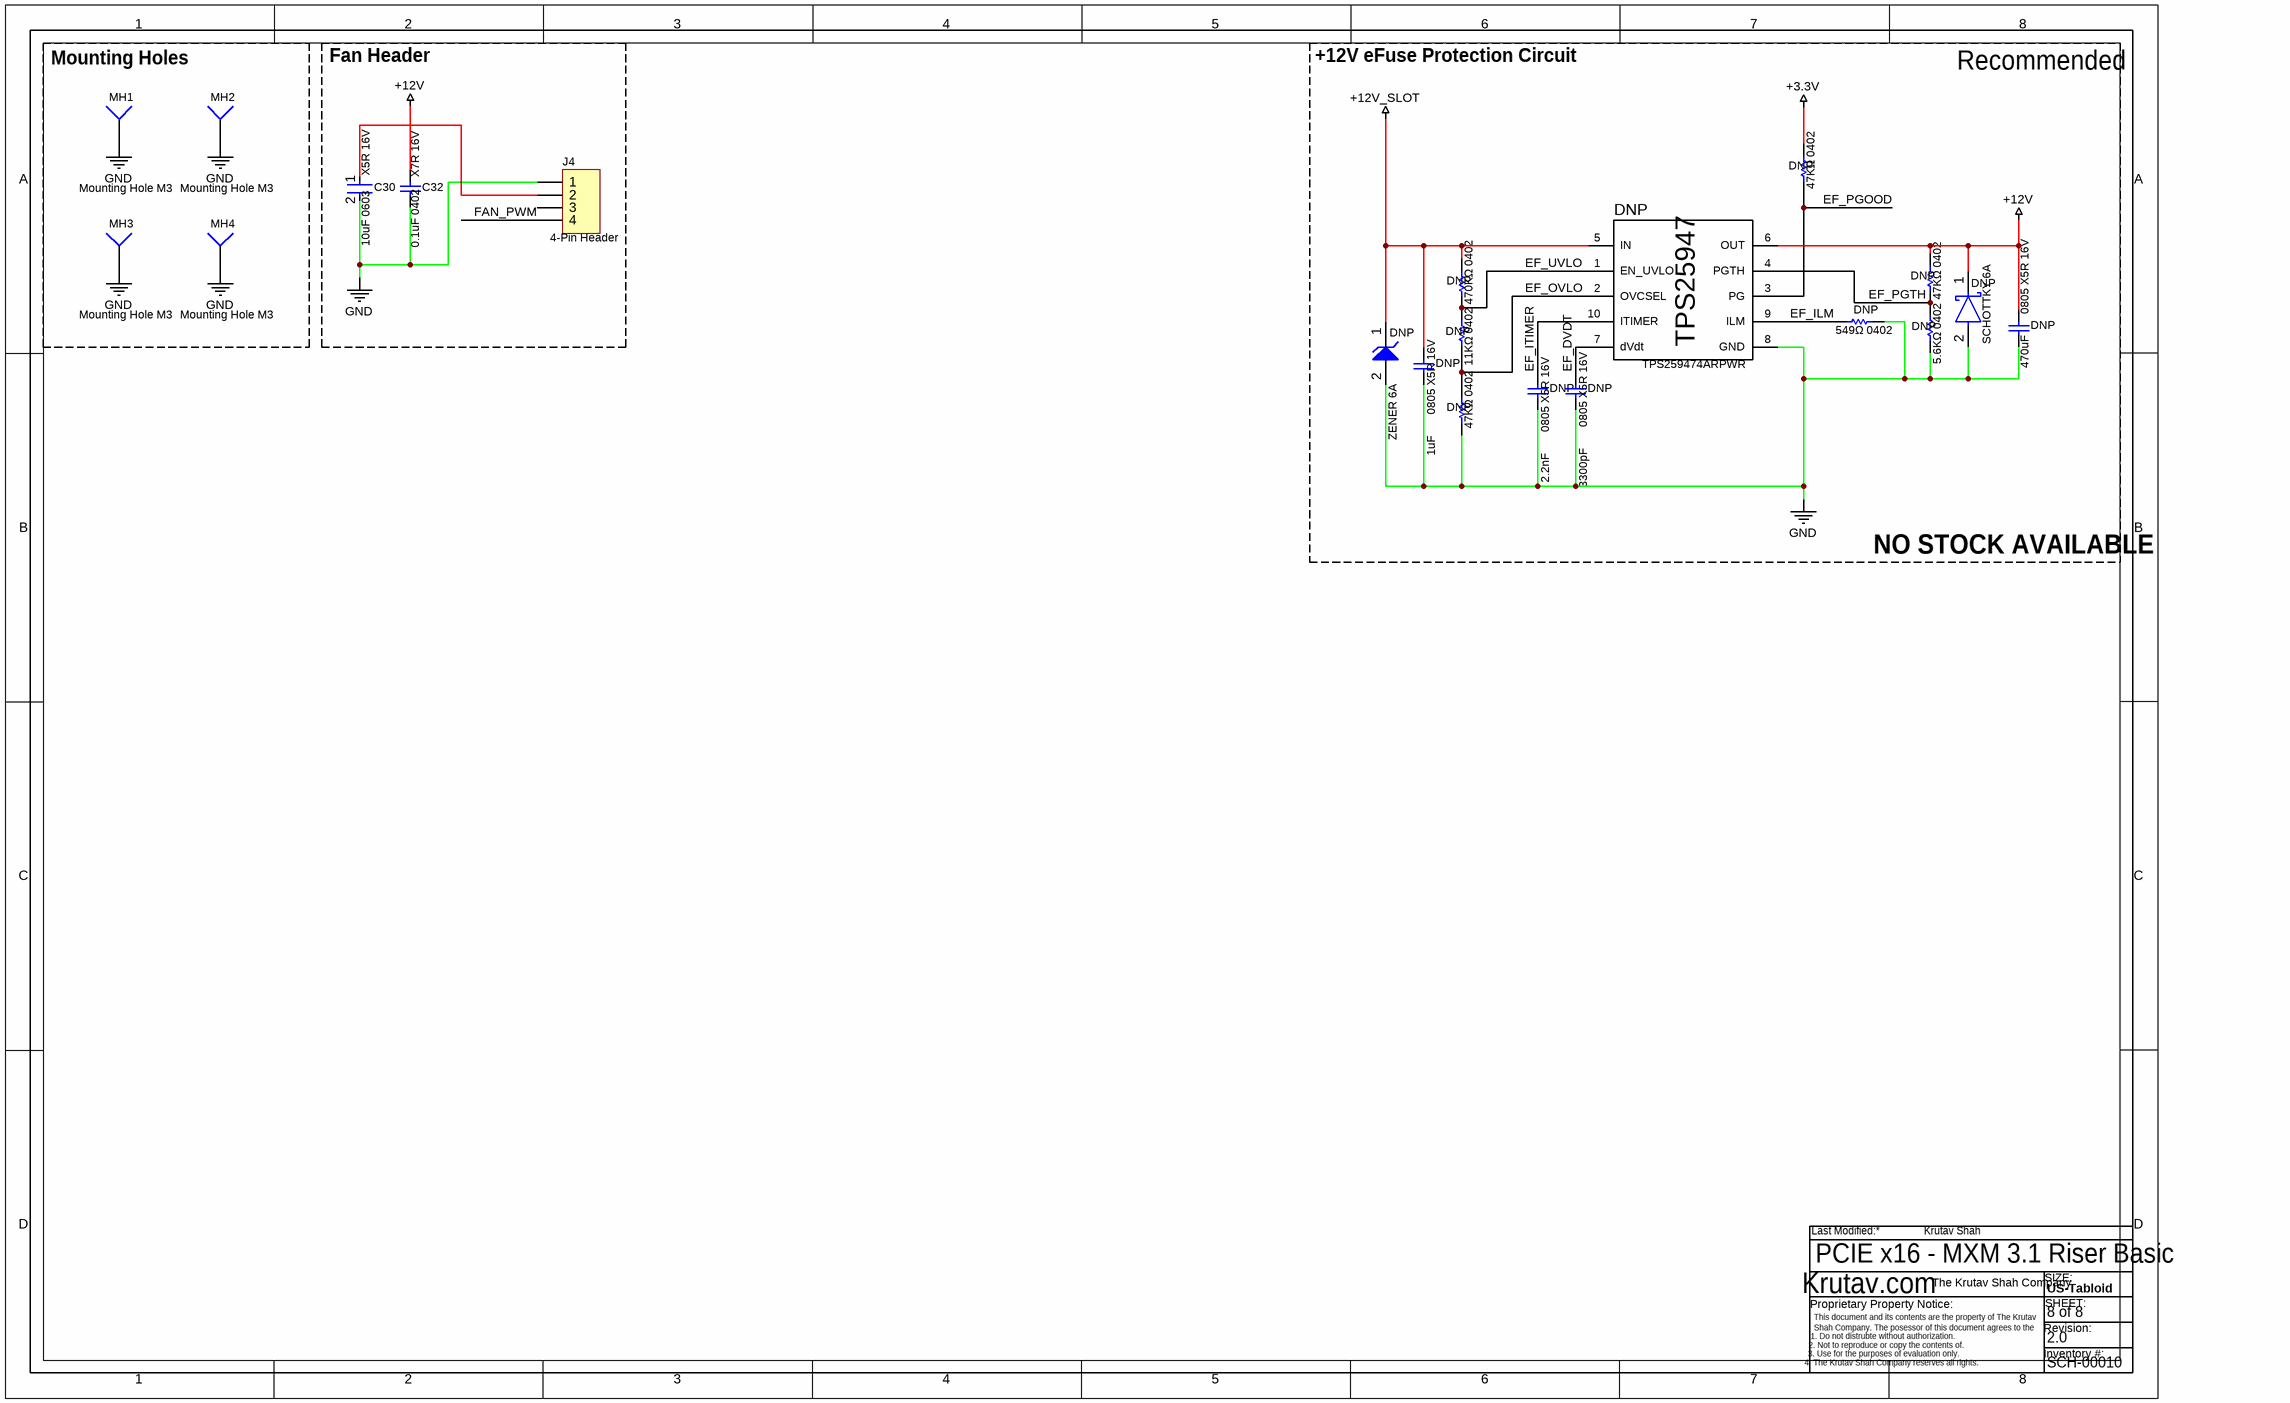
[diagram p8: Miscellaneous.SchDoc]

### Parts
(Parts that share a designator on the sheet are numbered #1, #2 ... from top to bottom, then left to right.)
C30  10uF 0603     X5R 16V  [FP-CL21-IPC_A]
C32  0.1uF 0402    X7R 16V  [CAPC1050X55X23ML05T13]
DNP#1  47KΩ 0402  [RESC0201(0603)_L]  (no BOM)
DNP#2  TPS259474ARPWR  [RPW0010A-MFG]  (no BOM)
DNP#3  47KΩ 0402  [RESC0201(0603)_L]  (no BOM)
DNP#4  470KΩ 0402  [RESC0201(0603)_L]  (no BOM)
DNP#5  470uF       0805 X5R 16V  [CAPC0603X33X15NL03T05]  (no BOM)
DNP#6  549Ω 0402  [RESC0201(0603)_L]  (no BOM)
DNP#7  5.6KΩ 0402  [RESC0201(0603)_L]  (no BOM)
DNP#8  ZENER 6A  [ONSC-SOD-123-2-425-04_V]  (no BOM)
DNP#9  11KΩ 0402  [RESC0201(0603)_L]  (no BOM)
DNP#10  SCHOTTKY 6A  [FP-425-04-IPC_B]  (no BOM)
DNP#11  1uF       0805 X5R 16V  [CAPC0603X33X15NL03T05]  (no BOM)
DNP#12  2.2nF       0805 X5R 16V  [CAPC0603X33X15NL03T05]  (no BOM)
DNP#13  3300pF       0805 X5R 16V  [CAPC0603X33X15NL03T05]  (no BOM)
DNP#14  47KΩ 0402  [RESC0201(0603)_L]  (no BOM)
J4  4-Pin Header  [HDR1X4]
MH1  Mounting Hole M3  [PIN1]  (mechanical)
MH2  Mounting Hole M3  [PIN1]  (mechanical)
MH3  Mounting Hole M3  [PIN1]  (mechanical)
MH4  Mounting Hole M3  [PIN1]  (mechanical)

### Blocks framed on the sheet
Mounting Holes: MH1-MH4
Fan Header: C30 C32 J4

### Nets
+3.3V: DNP#1.1
+12V: C32.2 DNP#2.6(OUT) DNP#3.1 DNP#5.1 DNP#10.1(C)
+12V_SLOT: DNP#2.5(IN) DNP#4.1 DNP#8.1(K) DNP#11.1
GND: C30.2 C32.1 DNP#2.8(GND) DNP#5.2 DNP#6.1 DNP#7.1 DNP#8.2(A) DNP#10.2(A) DNP#11.2 DNP#12.2 DNP#13.2 DNP#14.2 J4.1 MH1.1 MH2.1 MH3.1 MH4.1
EF_DVDT: DNP#2.7(dVdt) DNP#13.1
EF_ILM: DNP#2.9(ILM) DNP#6.2
EF_ITIMER: DNP#2.10(ITIMER) DNP#12.1
EF_OVLO: DNP#2.2(OVCSEL) DNP#9.1 DNP#14.1
EF_PGOOD: DNP#1.2 DNP#2.3(PG)
EF_PGTH: DNP#2.4(PGTH) DNP#3.2 DNP#7.2
EF_UVLO: DNP#2.1(EN_UVLO) DNP#4.2 DNP#9.2
FAN_PWM: J4.4
NetC30_1: C30.1 J4.2

Not connected (* = marked no-connect by the designer): J4 3

### Notes on the sheet
- +12V eFuse Protection Circuit
- Recommended
- NO STOCK AVAILABLE
- PCIE x16 - MXM 3.1 Riser Basic
- 8 of 8
- 2.0
- SCH-00010
- Last Modified:
- Krutav.com
- The Krutav Shah Company
- US-Tabloid
- SIZE:
- SHEET:
- This document and its contents are the property of The Krutav Shah Company. The posessor of this document agrees to the following:
- Proprietary Property Notice:
- 1. Do not distrubte without authorization.
- 3. Use for the purposes of evaluation only.
- 2. Not to reproduce or copy the contents of.
- 4. The Krutav Shah Company reserves all rights.
- Revision:
- Inventory #:
- (in symbol TPS259474ARPWR) TPS25947

### Library data of the parts
C30 = CMP-13271-002624-1: as C19 on sheet Power Sources and Supply; Case Code (Imperial): 0805; Thickness: 0.055inch; Mount: Surface Mount; Case Code (Metric): 2012; Capacitance: 4.7uF; Depth: 1.25mm; Lead Free: Lead Free; Case/Package: 0805; Voltage Rating: 25V; Package Quantity: 1; Width: 0.049inch; Radiation Hardening: No; Voltage Rating (DC): 25V; Length: 2mm; Dielectric: X5R; Height: 1.25mm; Packaging: Tape and Reel; Tolerance: 10%; Min Operating Temperature: -55°C; Max Operating Temperature: 85°C
C32 = CMP-2000-05439-1: as C18 on sheet Power Sources and Supply; Case Size/Dimension: 0402; Tolerance (%): ±10%; Manufacturer URL: http://www.samsungsem.com/global/index.jsp; Dielectric: X7R; Datasheet URL: https://datasheet.ciiva.com/29198/458718-da-01-en-vs-kondensator-0402-29198423.pdf; Rated Voltage: 16V; Datasheet Version: Nov-10
DNP#1 DNP#3 DNP#4 DNP#6 DNP#7 DNP#9 DNP#14 = CMP-1010-00755-1: as R19 on sheet Power Sources and Supply; Technology: SMT; Tolerance: 1 %; Power: 0.05 W
DNP#2 = TPS259474ARPWR: as U2 on sheet Power Sources and Supply; Type: DEV; RefDes: RefDes; Copyright: Copyright (C) 2021 Ultra Librarian. All rights reserved.; Manufacturer_Part_Number: TPS259474ARPWR; Digi-Key_Part_Number_1: 296-TPS259474ARPWRCT-ND; Digi-Key_Part_Number_2: 296-TPS259474ARPWRDKR-ND; Digi-Key_Part_Number_3: 296-TPS259474ARPWRTR-ND
DNP#5 DNP#11-DNP#13 = CMP-2010-00679-1: as C29 on sheet Power Sources and Supply
DNP#8 = CMP-1060-00606-1: Zener Voltage Regulator, 500 mW, 2-Pin SOD-123, Pb-Free, Tape and Reel; Manufacturer: On Semiconductor; PartNumber: MMSZ4691T1G; VZ Typ (V): 6.2; P Max (W): 0.5; DatasheetVersion: Rev. 9; ComponentLink1Description: Manufacturer URL; PackageReference: SOD-123-2-425-04; RoHS: Pb-Free; Mounting Technology: Surface Mount; ComponentLink3URL: http://www.onsemi.com/pub_link/Collateral/425-04.PDF; Packing: Tape and Reel; ComponentLink2URL: http://www.onsemi.com/pub_link/Collateral/MMSZ4678T1-D.PDF; PackageVersion: Rev. G, 10/2009; ComponentLink1URL: http://www.onsemi.com/; PackageDescription: 2-Pin SOD, Body 1.6 x 2.69 mm; ComponentLink2Description: Datasheet; ComponentLink3Description: Package Specification
DNP#10 = CMP-1055-00425-2: DIODE SCHOTTKY 20V 500MA SOD123; Polarity: Standard; Peak Non-Repetitive Surge Current: 5.5A; Forward Voltage: 385mV; Element Configuration: Single; Peak Reverse Current: 250uA; Max Repetitive Reverse Voltage (Vrrm): 20V; Voltage Rating (DC): 20V; Case/Package: SOD-123-2; Number of Pins: 2; Output Current: 500mA; Min Operating Temperature: -65°C; Lead Free: Lead Free; REACH SVHC: No SVHC; Max Reverse Voltage (DC): 20V; Termination: SMD/SMT; Average Rectified Current: 500mA; Max Surge Current: 5.5A; Package Quantity: 3000; Height: 1.12mm; Current Rating: 500mA; Forward Current: 500mA; Max Forward Surge Current (Ifsm): 5.5A; Packaging: Tape and Reel; Length: 2.69mm; Radiation Hardening: No; Max Reverse Leakage Current: 250uA; Width: 1.6mm; Contact Plating: Tin; Max Operating Temperature: 125°C
J4 = Header 4: Header, 4-Pin; LatestRevisionDate: 17-Jul-2002; LatestRevisionNote: Re-released for DXP Platform.; Publisher: Altium Limited
MH1 MH2 = Socket: Mounting Hole, 6mm diameter, 3.2mm hole diameter.; LatestRevisionDate: 17-Jul-2002; LatestRevisionNote: Re-released for DXP Platform.; Publisher: Altium Limited
MH3 MH4 = Socket: Mounting Hole, 6x4mm, 3.2mm hole diameter.; LatestRevisionDate: 17-Jul-2002; LatestRevisionNote: Re-released for DXP Platform.; Publisher: Altium Limited

## Nets that join several sheets
+3.3V: PCIE x1 Edge Connector Interface (P1.A9 P1.A10 P1.B8), Power Sources and Supply (8 pins), MXM 3.1 Connector Interface (12 pins), Display Interface (6 pins), Miscellaneous (DNP#1.1)
+5V: Power Sources and Supply (8 pins), MXM 3.1 Connector Interface (J1.1)
+12V: Power Sources and Supply (11 pins), MXM 3.1 Connector Interface (J1.E1 J1.E2), Miscellaneous (5 pins)
+12V_SLOT: PCIE x1 Edge Connector Interface (5 pins), Power Sources and Supply (C29.1 R40.1 U2.5), Miscellaneous (DNP#2.5 DNP#4.1 DNP#8.1 DNP#11.1)
GND: PCIE x1 Edge Connector Interface (9 pins), Power Sources and Supply (29 pins), MXM 3.1 Connector Interface (75 pins), Display Interface (8 pins), Miscellaneous (17 pins)